# EAGLE design 612_jetracer_328_020018 (EAGLE 9.6.2)
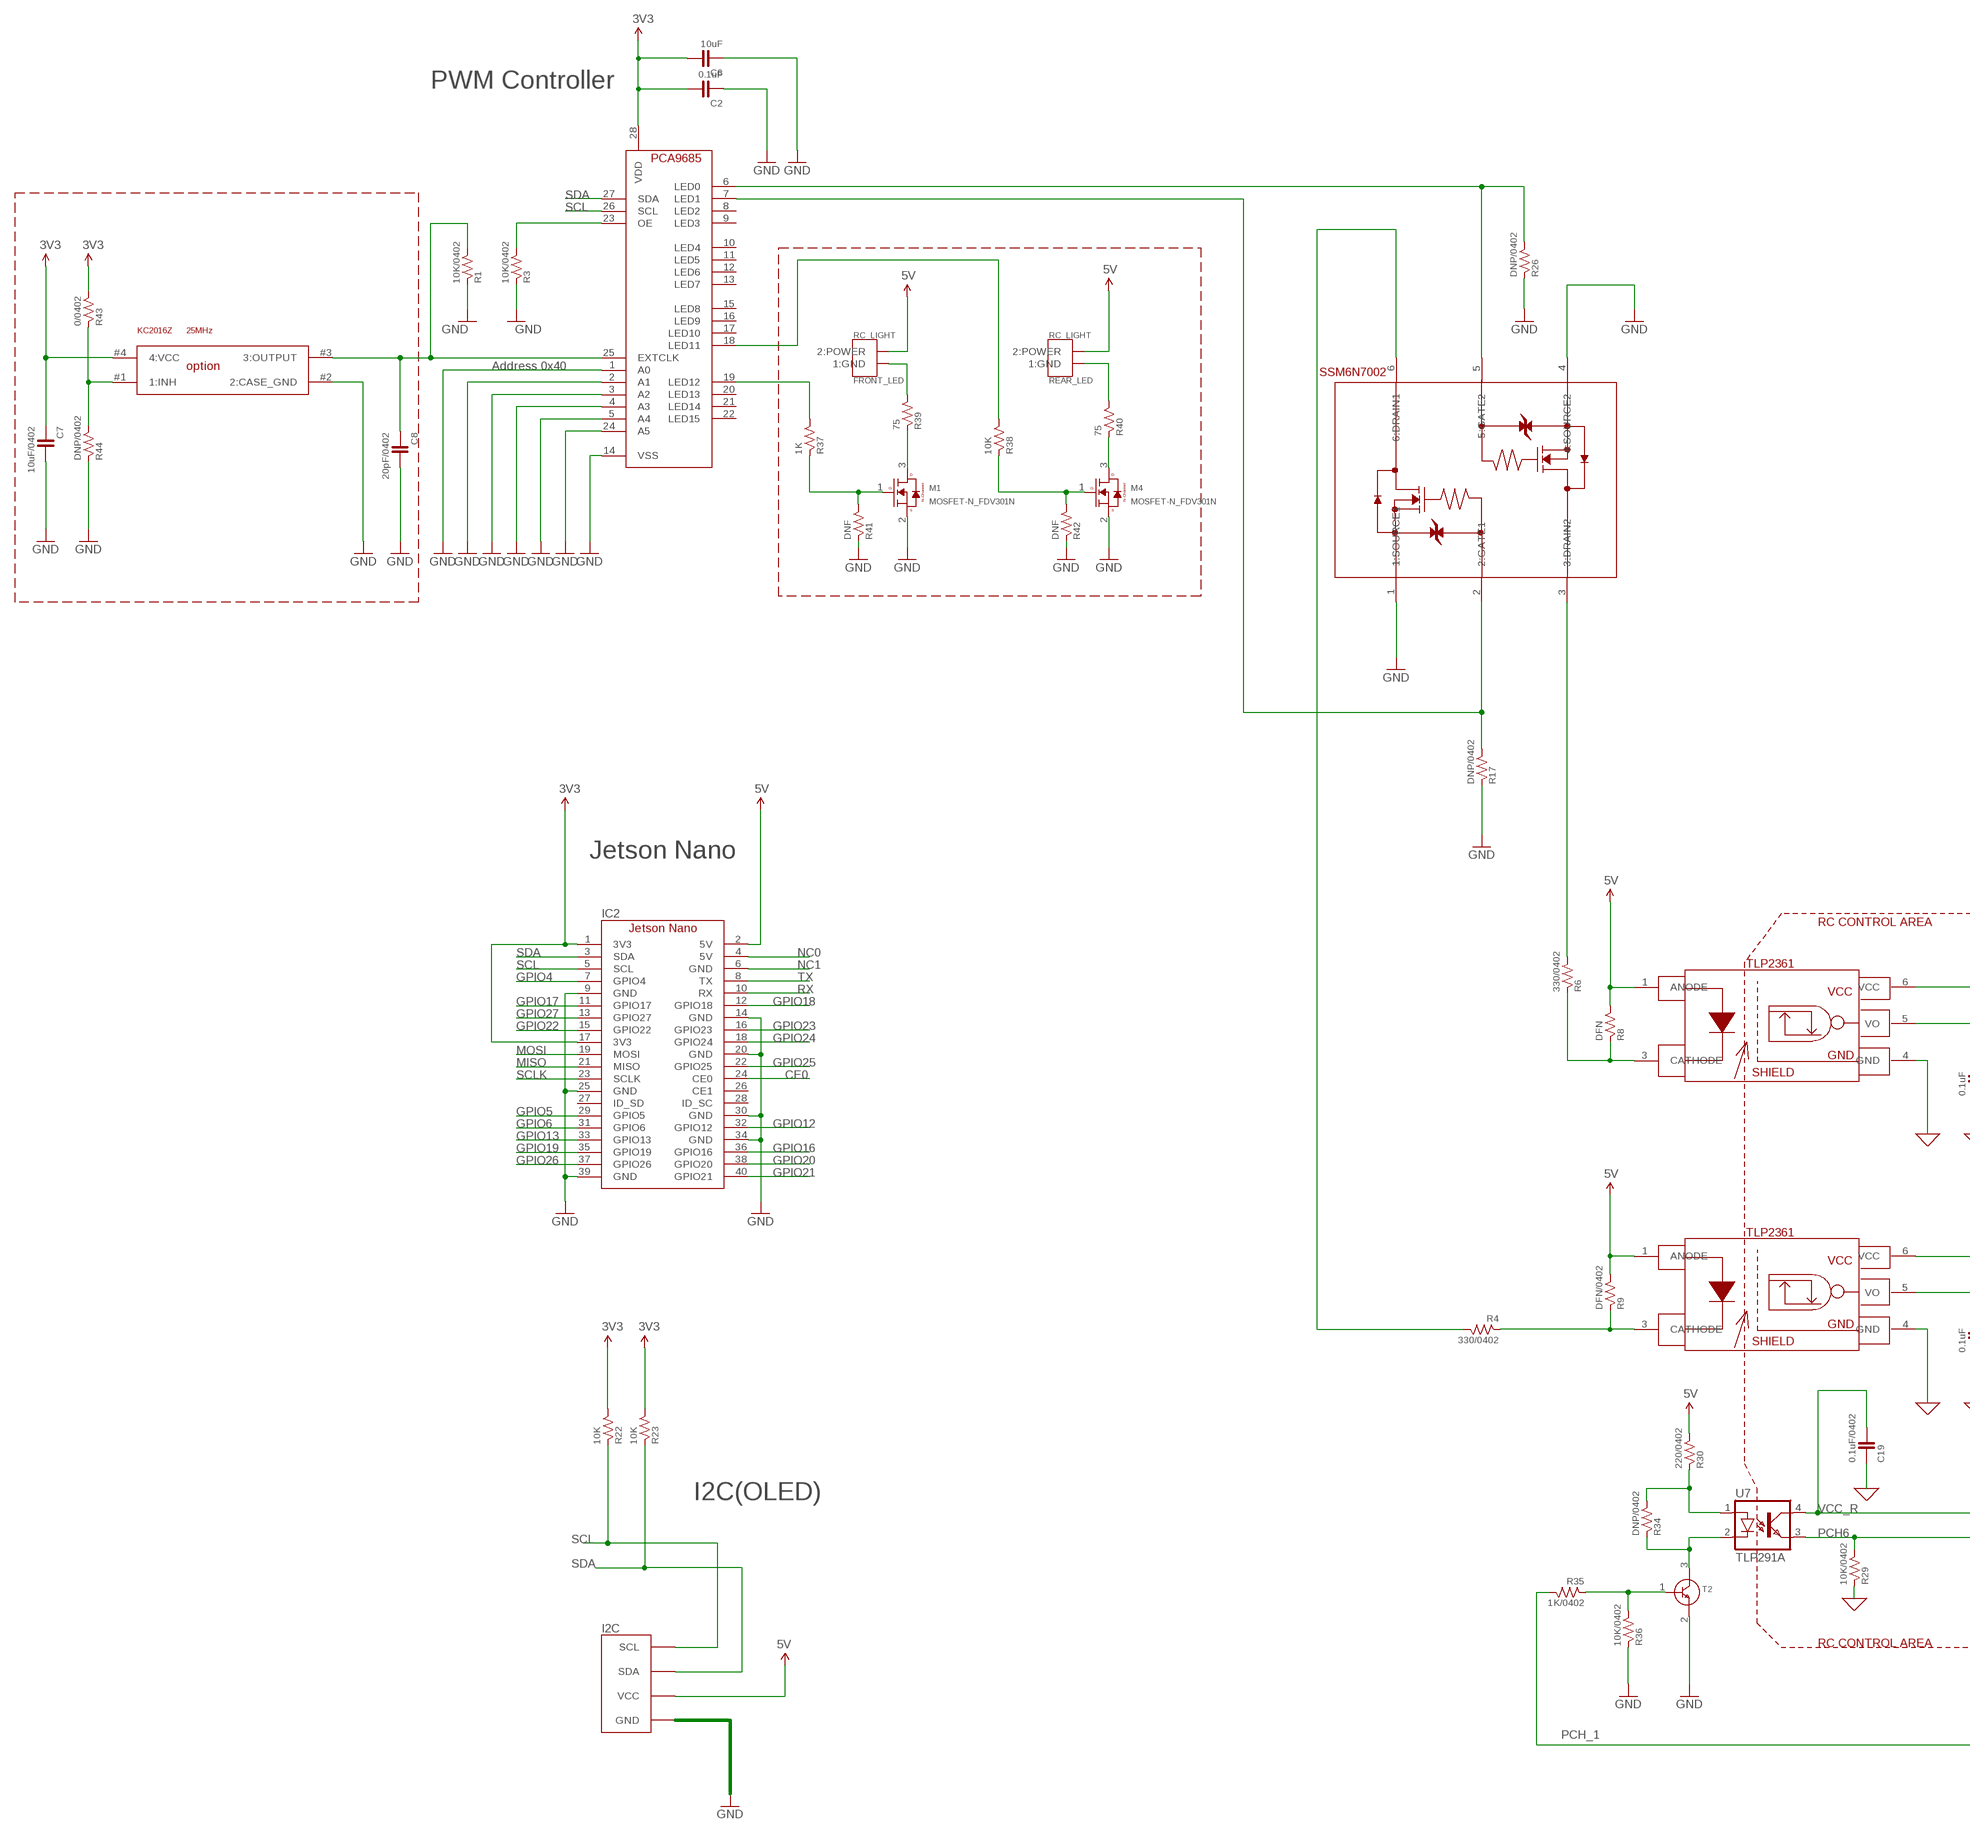
[diagram p0: schematic, sheet 1, part 1 of 3]
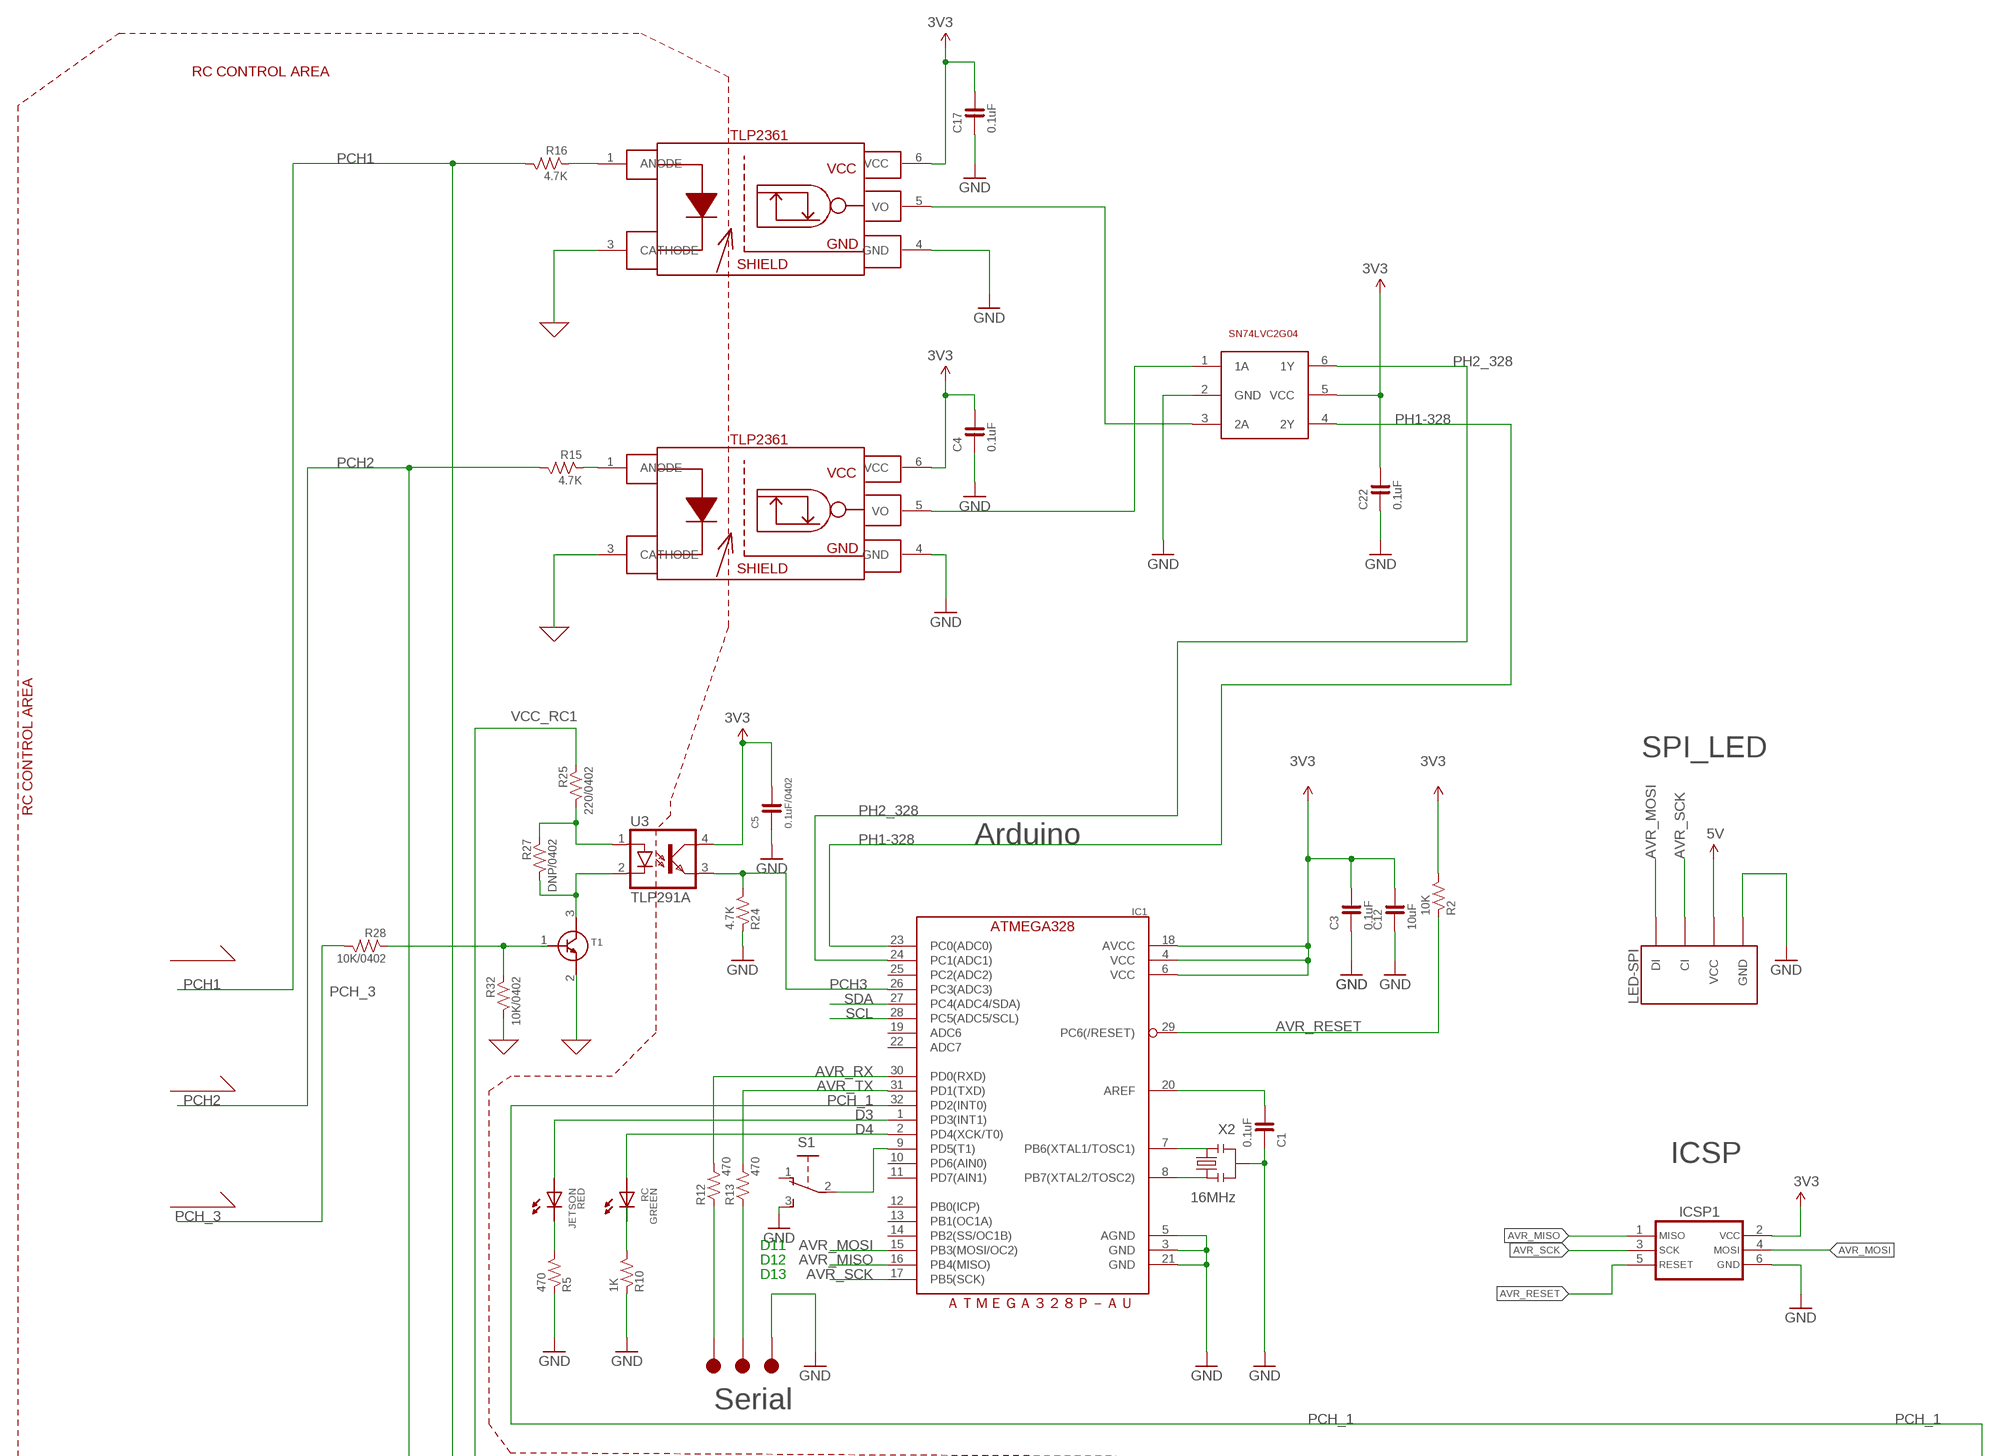
[diagram p1: schematic, sheet 1, part 2 of 3]
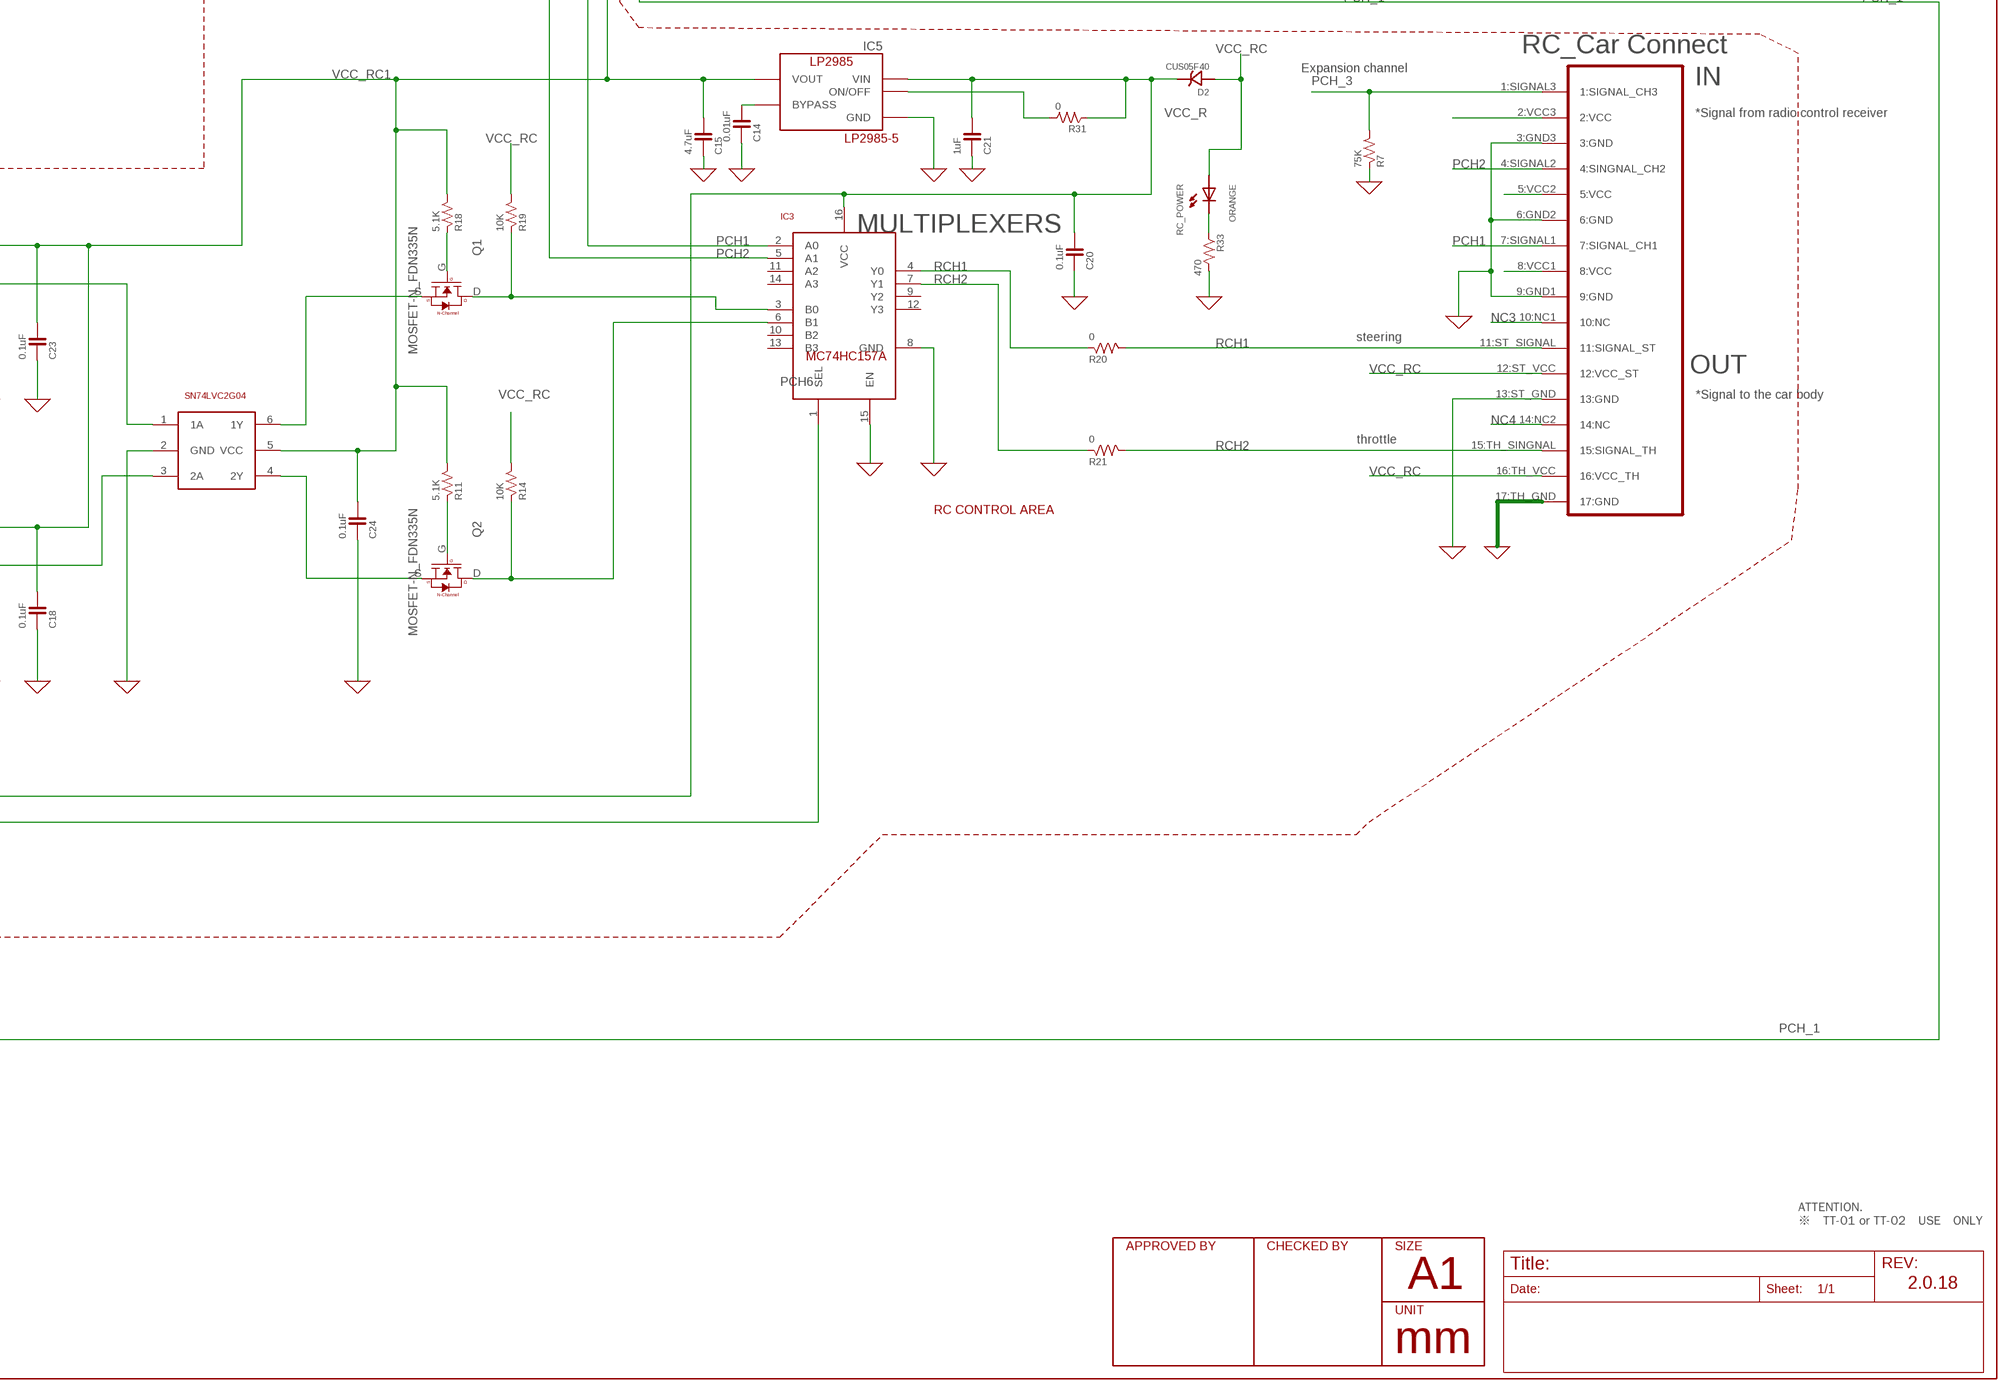
[diagram p2: schematic, sheet 1, part 3 of 3]

## Parts
C1  0.1uF  CAPACITOR-0603  [0603]
C2  0.1uF  CAPACITOR-0603  [0603]
C3  0.1uF  CAPACITOR-0402  [0402]
C4  0.1uF  CAPACITOR-0402  [0402]
C5  0.1uF/0402  CAPACITOR-0402  [0402]
C6  10uF  CAPACITOR-0603  [0603]
C7  10uF/0402  CAPACITOR-0402  [0402]
C8  20pF/0402  CAPACITOR-0402  [0402]
C12  10uF  CAPACITOR-0402  [0402]
C14  0.01uF  CAPACITOR-0603  [0603]
C15  4.7uF  CAPACITOR-0603  [0603]
C17  0.1uF  CAPACITOR-0603  [0603]
C18  0.1uF  CAPACITOR-0603  [0603]
C19  0.1uF/0402  CAPACITOR-0402  [0402]
C20  0.1uF  CAPACITOR-0603  [0603]
C21  1uF  CAPACITOR-0603  [0603]
C22  0.1uF  CAPACITOR-0402  [0402]
C23  0.1uF  CAPACITOR-0603  [0603]
C24  0.1uF  CAPACITOR-0603  [0603]
D2  CUS05F40  [CUS05F40]
FRONT_LED  RC_LIGHT  [PNHEADER_2.54_SMT_LEDLIGHT]
I2C  FABO-I2C_BM04B  [I2C-BM04B-PASS-1]
IC1  ATMEGA328P-AU  [TQFP-32]
IC2  JETSON_NANO_NOBORDER  [JETSON_NANO_NOBOARDER]
IC3  MULTIPLEXERSMC74HC157A  [TSSOP-16]
IC4  PCA9685_BOTTOM  [PCA9685_BOTTOM]
IC5  LP2985-33DBV  [SOT-23-5]
ICSP1  ICSP_AVR-TC_NOHOLE  [TC2030]
JETSON  GREEN  LED-0603  [0603]
LED-SPI  FABO-SPI-LED-BM04B  [SPI-BM04B-PASS-1]
M1  MOSFET-N_FDV301N  [SOT-23]
M4  MOSFET-N_FDV301N  [SOT-23]
Q1  MOSFET-N_FDN335N  [SUPERSOT-3]
Q2  MOSFET-N_FDN335N  [SUPERSOT-3]
R1  10K/0402  RESISTOR-0402  [0402]
R2  10K  RESISTOR-0603  [0603]
R3  10K/0402  RESISTOR-0402  [0402]
R4  330/0402  RESISTOR-0402  [0402]
R5  470  RESISTOR-0603  [0603]
R6  330/0402  RESISTOR-0402  [0402]
R7  75K  RESISTOR-0603  [0603]
R8  DFN  RESISTOR-0603  [0603]
R9  DFN/0402  RESISTOR-0402  [0402]
R10  1K  RESISTOR-0603  [0603]
R11  5.1K  RESISTOR-0603  [0603]
R12  470  RESISTOR-0603  [0603]
R13  470  RESISTOR-0603  [0603]
R14  10K  RESISTOR-0603  [0603]
R15  4.7K  RESISTOR-0603  [0603]
R16  4.7K  RESISTOR-0603  [0603]
R17  DNP/0402  RESISTOR-0402  [0402]
R18  5.1K  RESISTOR-0603  [0603]
R19  10K  RESISTOR-0603  [0603]
R20  0  RESISTOR-0603  [0603]
R21  0  RESISTOR-0603  [0603]
R22  10K  RESISTOR-0603  [0603]
R23  10K  RESISTOR-0603  [0603]
R24  4.7K  RESISTOR-0603  [0603]
R25  220/0402  RESISTOR-0402  [0402]
R26  DNP/0402  RESISTOR-0402  [0402]
R27  DNP/0402  RESISTOR-0402  [0402]
R28  10K/0402  RESISTOR-0402  [0402]
R29  10K/0402  RESISTOR-0402  [0402]
R30  220/0402  RESISTOR-0402  [0402]
R31  0  RESISTOR-0603  [0603]
R32  10K/0402  RESISTOR-0402  [0402]
R33  470  RESISTOR-0603  [0603]
R34  DNP/0402  RESISTOR-0402  [0402]
R35  1K/0402  RESISTOR-0402  [0402]
R36  10K/0402  RESISTOR-0402  [0402]
R37  1K  RESISTOR-0603  [0603]
R38  10K  RESISTOR-0603  [0603]
R39  75  RESISTOR-0603  [0603]
R40  75  RESISTOR-0603  [0603]
R41  DNF  RESISTOR-0603  [0603]
R42  DNF  RESISTOR-0603  [0603]
R43  0/0402  RESISTOR-0402  [0402]
R44  DNP/0402  RESISTOR-0402  [0402]
RC  RED  LED-0603  [0603]
RC_POWER  ORANGE  LED-0603  [0603]
REAR_LED  RC_LIGHT  [PNHEADER_2.54_SMT_LEDLIGHT]
S1  SLIDE-SSSS810701  [SSSS810701]
T1  TRANSISTOR-NPN  [SOT-23]
T2  TRANSISTOR-NPN  [SOT-23]
T5  SN74LVC2G04  [SOT-23-6]
T6  SN74LVC2G04  [SOT-23-6]
TP1  TP-15  [TP-15]
TP2  TP-15  [TP-15]
TP3  TP-15  [TP-15]
U3  TLP291A  [11-3C1]
U7  TLP291A  [11-3C1]
U8  TLP2361  [TLP2361]
U9  TLP2361  [TLP2361]
U10  TLP2361  [TLP2361]
U11  TLP2361  [TLP2361]
U$1  RC_17PIN_OUTIN  [PNHEADER_2.54_SMT_17PIN_RC_TT01_02]
U$6  SSM6N7002KFU  [US6]
U$11  KC2016Z  [KC2016Z]
X2  16MHz  RESONATOR  [CSTNE_V_C]

## Nets
0: C14.1 C15.1 C18.1 C19.1 C20.1 C21.1 C23.1 C24.1 IC3.8(GND) IC3.15(EN) IC5.2(GND) R7.1 R29.1 R32.2 R33.2 T1.2(E) T6.2(GND) U8.3(CATHODE) U9.3(CATHODE) U10.4(GND) U11.4(GND) U$1.3:GND3(3:GND) U$1.6:GND2(6:GND) U$1.9:GND1(9:GND) U$1.13:ST_GND(13:GND) U$1.17:TH_GND(17:GND) ; supply symbol labelled GND
3V3: C2.2 C3.2 C4.2 C5.2 C6.2 C7.1 C12.2 C17.2 C22.2 IC1.4(VCC) IC1.6(VCC) IC1.18(AVCC) IC2.1(3V3) IC2.17(3V3) IC4.28(VDD) ICSP1.2 R2.2 R22.2 R23.2 R43.2 T5.5(VCC) U3.4(COL) U8.6(VCC) U9.6(VCC) U$11.#4(4:VCC)
5V: FRONT_LED.2:POWER I2C.5V(VCC) IC2.2(5V) LED-SPI.5V(VCC) R8.2 R9.2 R30.2 REAR_LED.2:POWER U10.1(ANODE) U11.1(ANODE)
AVR_MISO: IC1.16(PB4(MISO)) ICSP1.1
AVR_MOSI: IC1.15(PB3(MOSI/OC2)) ICSP1.4 LED-SPI.DI
AVR_RESET: IC1.29(PC6(/RESET)) ICSP1.5 R2.1
AVR_RX: IC1.30(PD0(RXD)) R12.2
AVR_SCK: IC1.17(PB5(SCK)) ICSP1.3 LED-SPI.CI
AVR_TX: IC1.31(PD1(TXD)) R13.2
CE0: IC2.24(CE0)
D3: IC1.1(PD3(INT1)) RC.ANODE
D4: IC1.2(PD4(XCK/T0)) JETSON.ANODE
GND: C1.1 C2.1 C3.1 C4.1 C5.1 C6.1 C7.2 C8.2 C12.1 C17.1 C22.1 I2C.GND IC1.3(GND) IC1.5(AGND) IC1.21(GND) IC2.9(GND) IC2.14(GND) IC2.20(GND) IC2.25(GND) IC2.30(GND) IC2.34(GND) IC2.39(GND) IC4.1(A0) IC4.2(A1) IC4.3(A2) IC4.4(A3) IC4.5(A4) IC4.14(VSS) IC4.24(A5) ICSP1.6 LED-SPI.GND M1.2(S) M4.2(S) R1.1 R3.1 R5.1 R10.1 R17.1 R24.1 R26.1 R36.1 R41.1 R42.1 R44.1 S1.3 T2.2(E) T5.2(GND) TP3.1 U8.4(GND) U9.4(GND) U$6.1(1:SOURCE1) U$6.4(4:SOURCE2) U$11.#2(2:CASE_GND) X2.2
GPIO4: IC2.7(GPIO4)
GPIO5: IC2.29(GPIO5)
GPIO6: IC2.31(GPIO6)
GPIO12: IC2.32(GPIO12)
GPIO13: IC2.33(GPIO13)
GPIO16: IC2.36(GPIO16)
GPIO17: IC2.11(GPIO17)
GPIO18: IC2.12(GPIO18)
GPIO19: IC2.35(GPIO19)
GPIO20: IC2.38(GPIO20)
GPIO21: IC2.40(GPIO21)
GPIO22: IC2.15(GPIO22)
GPIO23: IC2.16(GPIO23)
GPIO24: IC2.18(GPIO24)
GPIO25: IC2.22(GPIO25)
GPIO26: IC2.37(GPIO26)
GPIO27: IC2.13(GPIO27)
MISO: IC2.21(MISO)
MOSI: IC2.19(MOSI)
N$2: IC4.7(LED1) R17.2 U$6.2(2:GATE1)
N$3: IC3.3(B0) Q1.D R19.1
N$4: C1.2 IC1.20(AREF)
N$5: IC1.8(PB7(XTAL2/TOSC2)) X2.3
N$6: R12.1 TP1.1
N$7: IC4.23(OE) R3.2
N$8: C8.1 IC4.25(EXTCLK) R1.2 U$11.#3(3:OUTPUT)
N$9: R15.1 U9.1(ANODE)
N$10: T5.1(1A) U9.5(VO)
N$11: T5.3(2A) U8.5(VO)
N$12: R16.1 U8.1(ANODE)
N$13: IC4.6(LED0) R26.2 U$6.5(5:GATE2)
N$14: T6.1(1A) U10.5(VO)
N$15: IC1.7(PB6(XTAL1/TOSC1)) X2.1
N$16: IC1.9(PD5(T1)) S1.2
N$17: R13.1 TP2.1
N$18: T6.3(2A) U11.5(VO)
N$19: R5.2 RC.CATHODE
N$20: JETSON.CATHODE R10.2
N$21: R4.2 U$6.6(6:DRAIN1)
N$22: R6.2 U$6.3(3:DRAIN2)
N$23: R6.1 R8.1 U10.3(CATHODE)
N$24: R4.1 R9.1 U11.3(CATHODE)
N$25: R25.2 R27.1 U3.1(A)
N$26: R27.2 T1.3(C) U3.2(C)
N$27: R28.1 R32.1 T1.1(B)
N$28: R33.1 RC_POWER.CATHODE
N$29: R35.1 R36.2 T2.1(B)
N$30: R34.1 T2.3(C) U7.2(C)
N$31: C14.2 IC5.4(BYPASS)
N$32: IC5.3(ON/OFF) R31.2
N$33: R30.1 R34.2 U7.1(A)
N$34: Q2.S T6.4(2Y)
N$35: R21.2 U$1.15:TH_SINGNAL(15:SIGNAL_TH)
N$36: R20.2 U$1.11:ST_SIGNAL(11:SIGNAL_ST)
N$37: Q1.S T6.6(1Y)
N$38: IC4.19(LED12) R37.2
N$39: Q2.G R11.1
N$40: Q1.G R18.1
N$41: IC4.18(LED11) R38.2
N$42: IC3.6(B1) Q2.D R14.1
N$43: M1.1(G) R37.1 R41.2
N$44: M4.1(G) R38.1 R42.2
N$45: FRONT_LED.1:GND R39.2
N$46: M1.3(D) R39.1
N$47: M4.3(D) R40.1
N$48: R40.2 REAR_LED.1:GND
N$49: R43.1 R44.2 U$11.#1(1:INH)
NC0: IC2.4(5V)
NC1: IC2.6(GND)
NC3: U$1.10:NC1(10:NC)
NC4: U$1.14:NC2(14:NC)
PCH1: IC3.2(A0) R16.2 U$1.7:SIGNAL1(7:SIGNAL_CH1)
PCH2: IC3.5(A1) R15.2 U$1.4:SIGNAL2(4:SINGNAL_CH2)
PCH3: IC1.26(PC3(ADC3)) R24.2 U3.3(EMI)
PCH6: IC3.1(SEL) R29.2 U7.3(EMI)
PCH_1: IC1.32(PD2(INT0)) R35.2
PCH_3: R7.2 R28.2 U$1.1:SIGNAL3(1:SIGNAL_CH3)
PH1-328: IC1.23(PC0(ADC0)) T5.4(2Y)
PH2_328: IC1.24(PC1(ADC1)) T5.6(1Y)
RCH1: IC3.4(Y0) R20.1
RCH2: IC3.7(Y1) R21.1
RX: IC2.10(RX)
SCL: I2C.SCL IC1.28(PC5(ADC5/SCL)) IC2.5(SCL) IC4.26(SCL) R22.1
SCLK: IC2.23(SCLK)
SDA: I2C.SDA IC1.27(PC4(ADC4/SDA)) IC2.3(SDA) IC4.27(SDA) R23.1
TX: IC2.8(TX)
VCC_R: C19.2 C20.2 C21.2 D2.C(CATHODE) IC3.16(VCC) IC5.1(VIN) R31.1 U7.4(COL)
VCC_RC: D2.A(ANODE) R14.2 R19.2 RC_POWER.ANODE U$1.2:VCC3(2:VCC) U$1.5:VCC2(5:VCC) U$1.8:VCC1(8:VCC) U$1.12:ST_VCC(12:VCC_ST) U$1.16:TH_VCC(16:VCC_TH)
VCC_RC1: C15.2 C18.2 C23.2 C24.2 IC5.5(VOUT) R11.2 R18.2 R25.1 T6.5(VCC) U10.6(VCC) U11.6(VCC)
Unconnected: IC1.10(PD6(AIN0)) IC1.11(PD7(AIN1)) IC1.12(PB0(ICP)) IC1.13(PB1(OC1A)) IC1.14(PB2(SS/OC1B)) IC1.19(ADC6) IC1.22(ADC7) IC1.25(PC2(ADC2)) IC2.26(CE1) IC2.27(ID_SD) IC2.28(ID_SC) IC3.9(Y2) IC3.10(B2) IC3.11(A2) IC3.12(Y3) IC3.13(B3) IC3.14(A3) IC4.8(LED2) IC4.9(LED3) IC4.10(LED4) IC4.11(LED5) IC4.12(LED6) IC4.13(LED7) IC4.15(LED8) IC4.16(LED9) IC4.17(LED10) IC4.20(LED13) IC4.21(LED14) IC4.22(LED15) S1.1

## Notes on the sheet
- RC CONTROL AREA
- PWM Controller
- SPI_LED
- RC CONTROL AREA
- Arduino
- option | Address 0x40
- ICSP
- D11
- D12
- D13
- ＡＴＭＥＧＡ３２８Ｐ－ＡＵ
- Serial
- RC_Car Connect
- Expansion channel
- IN
- Jetson Nano
- *Signal from radio control receiver
- LP2985-5
- RC CONTROL AREA
- MULTIPLEXERS
- steering
- MC74HC157A
- OUT
- *Signal to the car body
- throttle
- RC CONTROL AREA
- I2C(OLED)
- RC CONTROL AREA
- ATTENTION.
  ※　TT-01 or TT-02　USE　ONLY
- 2.0.18

## Library data of the parts
C1-C8 C12 C14 C15 C17 C20-C22 = FaBo-Capacitor:CAPACITOR: CAPACITOR
C18 C19 C23 C24 = FaBo-Capacitor:CAPACITOR: CAPACITOR; SPICEPREFIX: C
D2 = FaBo-Diode:CUS05F40
FRONT_LED REAR_LED = FaBo-PIN:RC_LIGHT
I2C = FaBo-Connetor:FABO-I2C
IC1 = component:ATMEGA328
IC2 = FaBo-Boards:JETSON_NANO
IC3 = FaBo-Multiplexers:MULTIPLEXERS
IC4 = FaBo-Motor:PCA9685
IC5 = FaBo-Supply:LP2985: LP2985
ICSP1 = component:ICSP_AVR
JETSON RC RC_POWER = FaBo-LED:LED
LED-SPI = FaBo-Connetor:FABO-SPI-LED
M1 M4 Q1 Q2 = FaBo-Mosfet:MOSFET-N
R1-R44 = FaBo-Resistors:RESISTOR: RESISTOR
S1 = FaBo-Switch:SLIDE
T1 T2 = FaBo-Transistor:TRANSISTOR
T5 T6 = FaBo-Transistor:SN74LVC2G04
TP1-TP3 = FaBo-Supply:TP
U3 U7 = FaBo_Photocoupler:TLP291A
U8-U11 = FaBo-etc:TLP2361
U$1 = FaBo-PIN:RC_17PIN_OUTIN
U$6 = FaBo-Mosfet:SSM6N7002KFU
U$11 = FaBo-Crystal:KC2016Z
X2 = component:RESONATOR

## Board
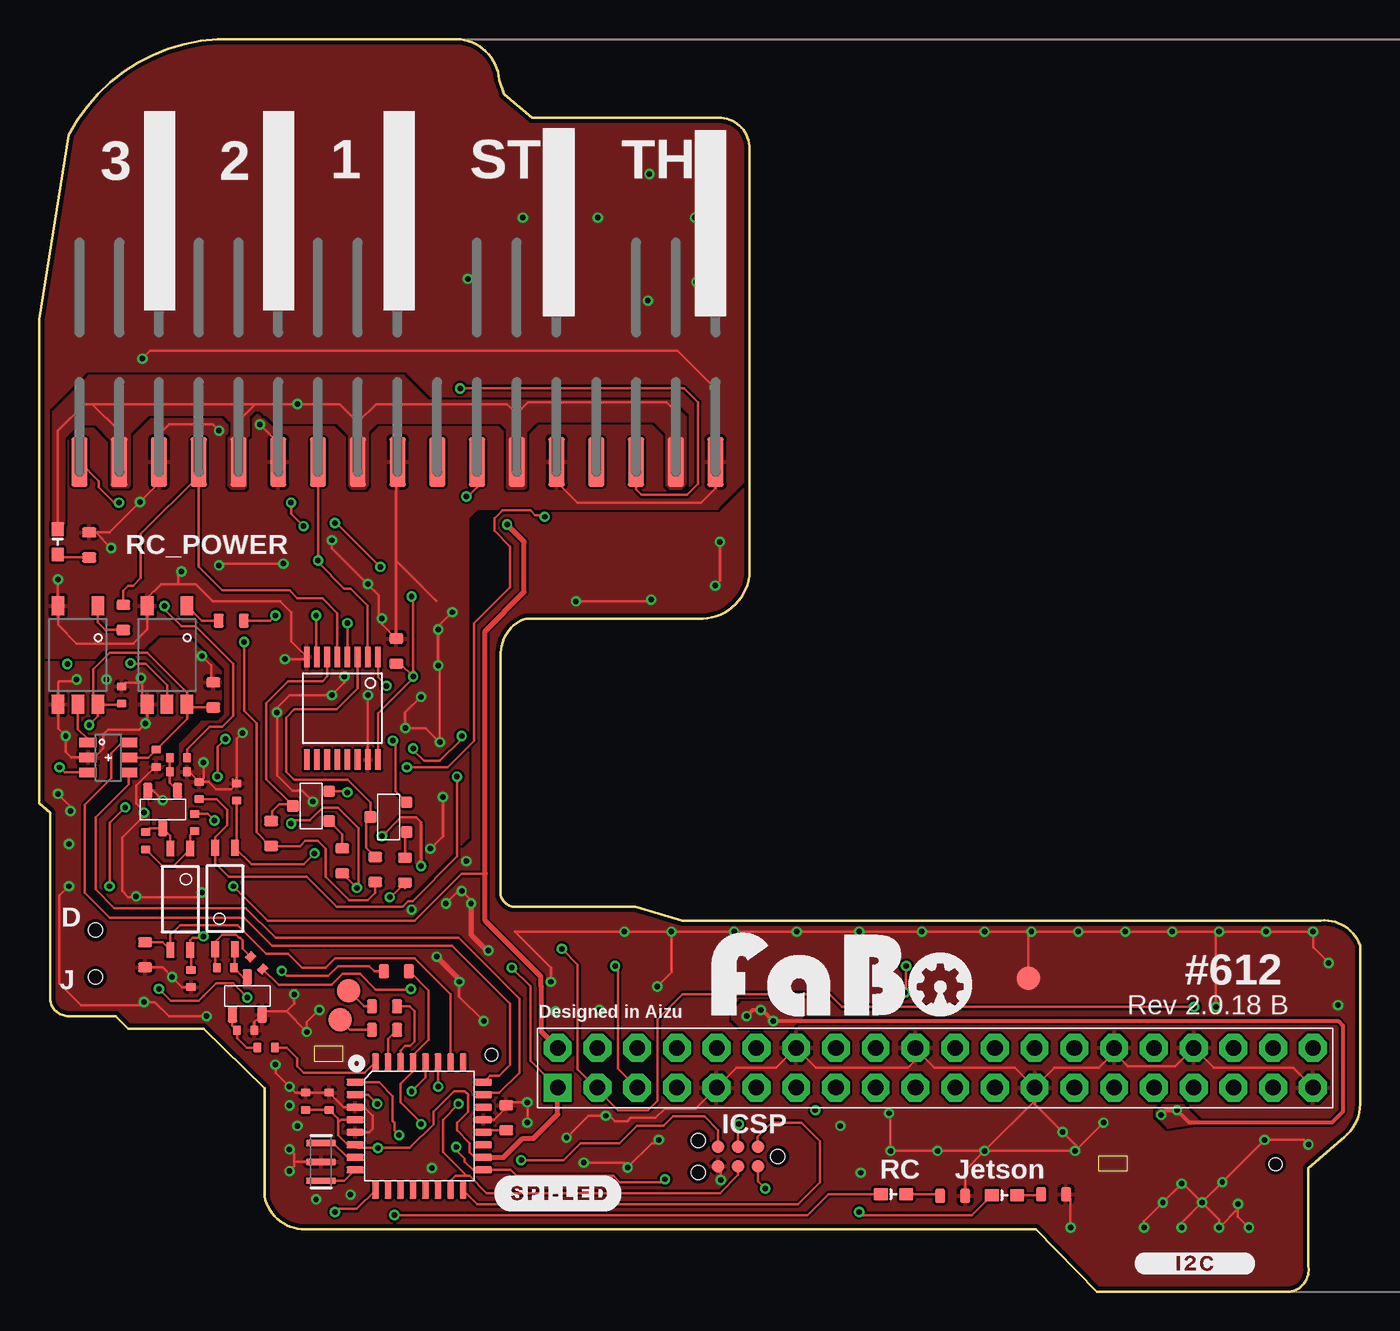
[diagram p3: board, top side]
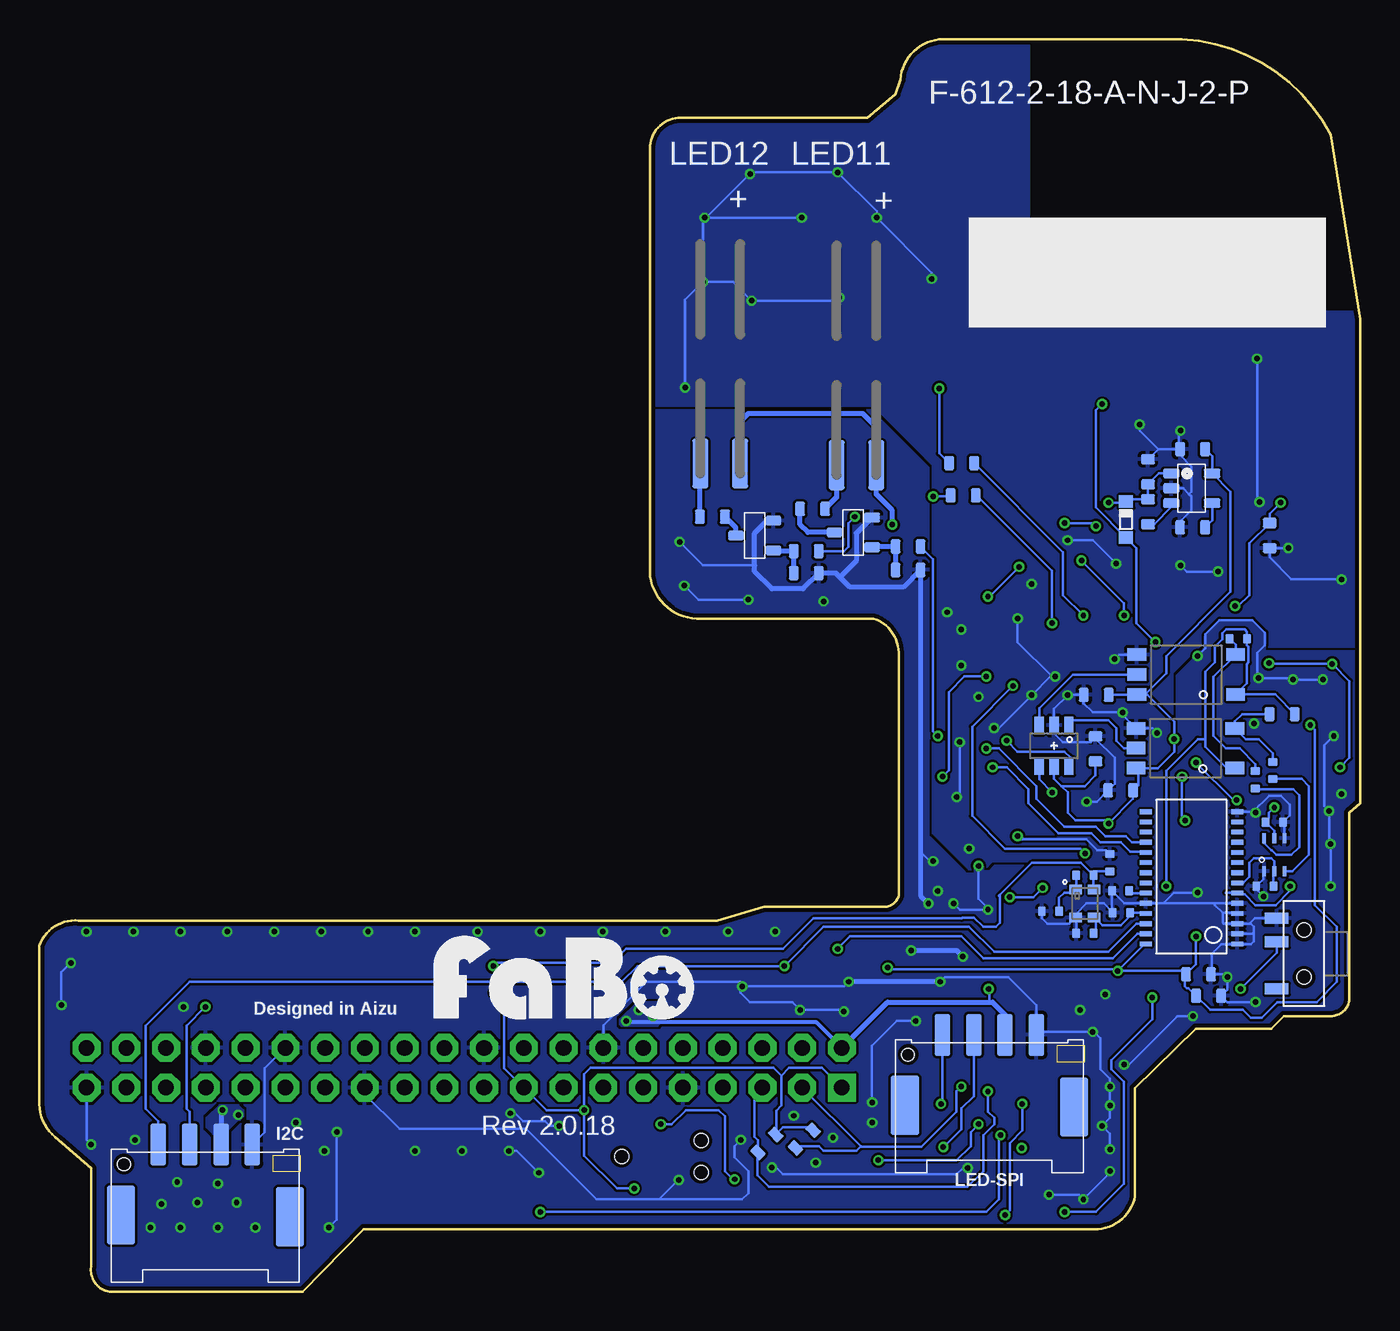
[diagram p4: board, bottom side, seen from below]

Size 84.42 x 80.01 mm. Coordinates in mm from the lower left corner, seen from the top.
Outline: 0,31.2 0,62.1 1.9,73.9 arc-60 11.4,80 26.4,80 arc-90 29.4,77.4 29.7,76.5 31.5,75 43.4,75 arc-90 45.4,73 45.4,46 arc-86 42.4,43 31.1,43 arc71 29.5,40.8 29.5,25.3 arc85 30.6,24.6 38.1,24.6 41.1,23.7 81.9,23.7 arc-78 84.4,22.1 84.4,12.5 arc-61 83.2,9.7 81.1,7.9 81.1,1.6 arc-90 79.9,0 67.6,0 63.7,4 17,4 arc-80 14.4,6.1 14.4,13 10.5,16.8 5.7,16.8 4.9,17.6 1.9,17.6 arc-85 0.7,18.7 0.7,30.6 0,31.2
Copper layers (1*16): Top 0.035mm / dielectric 1.6mm / Bottom 0.035mm
Design rules "PCBway": minimum track width 6mil, minimum drill 12mil, track to track 6mil, track to pad 6mil, pad to pad 6mil, via to via 6mil, smd to smd 6mil, copper to edge 10mil, drill to drill 10mil, minimum pad ring 10mil, minimum via ring 6mil, stop-mask expansion 2mil, vias tented up to drill 100mil, thermal gap 8mil
tKeepout: area 17,14.3 to 19.8,16.1; area 67.2,7.3 to 70,9.1
bKeepout: area 2.5,70.2 to 27,91.4
tRestrict: 2 lines
bRestrict: area -2.9,62.7 to 21.1,82.8

### Footprints (pad centres in the part's own frame; a part is rotated, then mirrored left to right if it is on the bottom)
0603 = smd 0.65 x 0.9: 1 -0.8,0; 2 0.8,0
0402 = smd 0.5 x 0.6: 1 -0.55,0; 2 0.55,0
CUS05F40 = smd 0.8 x 0.9: A -1.15,0; C 1.15,0
PNHEADER_2.54_SMT_LEDLIGHT = smd 1.02 x 3.17: 1:GND -1.27,0; 2:POWER 1.27,0
I2C-BM04B-PASS-1 = smd 1 x 2.7: 5V -1,0; GND -3,0; SCL 3,0; SDA 1,0 | smd 1.8 x 3.8: P$5 -5.4,4.6; P$6 5.4,4.5 | hole 0.8: 5.2,1.25
TQFP-32 = smd 1.1 x 0.45: 1 -4.1,2.8; 2 -4.1,2; 3 -4.1,1.2; 4 -4.1,0.4; 5 -4.1,-0.4; 6 -4.1,-1.2; 7 -4.1,-2; 8 -4.1,-2.8; 17 4.1,-2.8; 18 4.1,-2; 19 4.1,-1.2; 20 4.1,-0.4; 21 4.1,0.4; 22 4.1,1.2; 23 4.1,2; 24 4.1,2.8 | smd 0.45 x 1.1: 9 -2.8,-4.1; 10 -2,-4.1; 11 -1.2,-4.1; 12 -0.4,-4.1; 13 0.4,-4.1; 14 1.2,-4.1; 15 2,-4.1; 16 2.8,-4.1; 25 2.8,4.1; 26 2,4.1; 27 1.2,4.1; 28 0.4,4.1; 29 -0.4,4.1; 30 -1.2,4.1; 31 -2,4.1; 32 -2.8,4.1
JETSON_NANO_NOBOARDER = drill 1 pad 1.778 square: 1 1.27,1.27 | drill 1 pad 1.778 octagon: 2 1.27,3.81; 3 3.81,1.27; 4 3.81,3.81; 5 6.35,1.27; 6 6.35,3.81; 7 8.89,1.27; 8 8.89,3.81; 9 11.43,1.27; 10 11.43,3.81; 11 13.97,1.27; 12 13.97,3.81; 13 16.51,1.27; 14 16.51,3.81; 15 19.05,1.27; 16 19.05,3.81; 17 21.59,1.27; 18 21.59,3.81; 19 24.13,1.27; 20 24.13,3.81; 21 26.67,1.27; 22 26.67,3.81; 23 29.21,1.27; 24 29.21,3.81; 25 31.75,1.27; 26 31.75,3.81; 27 34.29,1.27; 28 34.29,3.81; 29 36.83,1.27; 30 36.83,3.81; 31 39.37,1.27; 32 39.37,3.81; 33 41.91,1.27; 34 41.91,3.81; 35 44.45,1.27; 36 44.45,3.81; 37 46.99,1.27; 38 46.99,3.81; 39 49.53,1.27; 40 49.53,3.81
TSSOP-16 = smd 0.36 x 1.3: 1 -2.275,-3.28; 2 -1.625,-3.28; 3 -0.975,-3.28; 4 -0.325,-3.28; 5 0.325,-3.28; 6 0.975,-3.28; 7 1.625,-3.28; 8 2.275,-3.28; 9 2.275,3.28; 10 1.625,3.28; 11 0.975,3.28; 12 0.325,3.28; 13 -0.325,3.28; 14 -0.975,3.28; 15 -1.625,3.28; 16 -2.275,3.28
PCA9685_BOTTOM = smd 0.3 x 0.75 bottom: 1 4.3,-2.93; 2 3.65,-2.93; 3 3,-2.93; 4 2.35,-2.93; 5 1.7,-2.93; 6 1.05,-2.93; 7 0.4,-2.93; 8 -0.25,-2.93; 9 -0.9,-2.93; 10 -1.55,-2.93; 11 -2.2,-2.93; 12 -2.85,-2.93; 13 -3.5,-2.93; 14 -4.15,-2.93; 15 -4.15,2.92; 16 -3.5,2.92; 17 -2.85,2.92; 18 -2.2,2.92; 19 -1.55,2.92; 20 -0.9,2.92; 21 -0.25,2.92; 22 0.4,2.92; 23 1.05,2.92; 24 1.7,2.92; 25 2.35,2.92; 26 3,2.92; 27 3.65,2.92; 28 4.3,2.92
SOT-23-5 = smd 0.6 x 1.05: 1 -0.95,-1.3; 2 0,-1.3; 3 0.95,-1.3; 4 0.95,1.3; 5 -0.95,1.3
TC2030 = smd 0.787 x 0.787: 1 1.27,-0.635; 2 1.27,0.635; 3 2.54,-0.635; 4 2.54,0.635; 5 3.81,-0.635; 6 3.81,0.635 | hole 0.889: 0,0; 5.08,-1.016; 5.08,1.016
0603' = smd 0.9 x 0.8: ANODE -0.8,0; CATHODE 0.8,0
SPI-BM04B-PASS-1 = smd 1 x 2.7: 5V -1,-0.1; CI 1,-0.1; DI 3,-0.1; GND -3,-0.1 | smd 1.8 x 3.8: P$5 -5.4,4.5; P$6 5.4,4.4 | hole 0.8: 5.2,1.15
SOT-23 = smd 0.6 x 1: 1 -0.95,-1.2; 2 0.95,-1.2; 3 0,1.2
SUPERSOT-3 = smd 0.76 x 0.76: D 0,1.15; G -0.95,-1.15; S 0.95,-1.15
SSSS810701 = smd 0.7 x 1.5: 1 -2.25,1.75; 2 0.75,1.75; 3 2.25,1.75 | hole 0.9: -1.5,0; 1.5,0
SOT-23-6 = smd 0.6 x 1.1: 1 -0.95,-1.3; 2 0,-1.3; 3 0.95,-1.3; 4 0.95,1.3; 5 0,1.3; 6 -0.95,1.3
TP-15 = smd 1.5 x 1.5: 1 0,0
11-3C1 = smd 1 x 0.5: 1 -3.24,0.635; 2 -3.24,-0.635; 3 3.24,-0.635; 4 3.24,0.635
TLP2361 = smd 0.8 x 1.2: 1 -1.27,-3.15; 3 1.27,-3.15; 4 1.27,3.15; 5 0,3.15; 6 -1.27,3.15
PNHEADER_2.54_SMT_17PIN_RC_TT01_02 = smd 1.02 x 3.17: 1:SIGNAL3 -20.32,0; 2:VCC3 -17.78,0; 3:GND3 -15.24,0; 4:SIGNAL2 -12.7,0; 5:VCC2 -10.16,0; 6:GND2 -7.62,0; 7:SIGNAL1 -5.08,0; 8:VCC1 -2.54,0; 9:GND1 0,0; 10:NC1 2.54,0; 11:ST_SIGNAL 5.08,0; 12:ST_VCC 7.62,0; 13:ST_GND 10.16,0; 14:NC2 12.7,0; 15:TH_SINGNAL 15.24,0; 16:TH_VCC 17.78,0; 17:TH_GND 20.32,0
US6 = smd 0.3 x 0.635: 1 -0.65,-1.05; 2 0,-1.05; 3 0.65,-1.05; 4 0.65,1.05; 5 0,1.05; 6 -0.65,1.05
KC2016Z = smd 0.6 x 0.8: #1 -0.9,-0.6; #2 0.9,-0.6; #3 0.9,0.6; #4 -0.9,0.6
CSTNE_V_C = smd 0.4 x 1.9: 1 1.2,0; 2 0,0; 3 -1.2,0

### Placement (x,y rotation side)
C1  29.84,11.12 270 top
C2  10.35,20.27 180 bottom
C3  18.52,12.17 270 top
C4  5.28,38.12 270 top
C5  9.7,20 90 top
C6  9.7,18.9 180 bottom
C7  16,27.4 90 bottom
C8  17.6,22.9 180 bottom
C12  17.02,12.17 270 top
C14  10.72,48.82 0 bottom
C15  10.72,53.83 0 bottom
C17  11.12,38.12 270 top
C18  16.88,38.12 0 bottom
C19  10.22,32.02 270 top
C20  22.82,40.92 270 top
C21  13.57,52.37 270 bottom
C22  7.47,34.07 90 top
C23  15.32,32.02 0 bottom
C24  16.92,34.67 270 bottom
D2  14.97,49.32 90 bottom
FRONT_LED  40.9,52.9 0 bottom
I2C  73.8,9.4 180 bottom
IC1  24.29,10.59 0 top
IC2  31.86,11.77 0 top
IC3  19.38,37.27 180 top
IC4  10.79,26.51 270 top
IC5  10.78,51.32 270 bottom
ICSP1  47.2,8.63 180 top
JETSON  GREEN  [0603']  54.59,6.24 0 top
LED-SPI  23.7,16.3 180 bottom
M1  38.7,48.3 90 bottom
M4  32.4,48.5 90 bottom
Q1  22.32,30.32 90 top
Q2  17.38,31.02 90 top
R1  15.28,24.22 0 bottom
R2  22.82,20.47 180 top
R3  15.32,25.62 0 bottom
R4  6.7,32.7 270 bottom
R5  64.82,6.22 180 top
R6  5.6,33.3 270 bottom
R7  5.8,48.3 90 bottom
R8  5,36.9 0 bottom
R9  7.8,41.7 0 bottom
R10  58.37,6.12 180 top
R11  19.38,27.52 270 top
R12  22.07,18.23 0 top
R13  22.07,16.73 0 top
R14  14.82,29.27 270 top
R15  5.38,43.07 90 top
R16  12.28,42.87 0 top
R17  6.1,25.9 0 bottom
R18  23.38,26.92 270 top
R19  21.48,26.97 270 top
R20  25.38,50.87 180 bottom
R21  25.48,52.92 180 bottom
R22  37.92,9.47 45 bottom
R23  35.53,9.75 45 bottom
R24  6.78,21.52 90 top
R25  9.93,29.97 270 top
R26  5.5,30 180 bottom
R27  6.8,28.8 90 top
R28  8.9,34.1 0 top
R29  12.62,31.92 270 top
R30  13.9,21 315 top
R31  13.57,49.82 270 bottom
R32  8.9,33.2 0 top
R33  3.2,47.7 90 top
R34  11.9,20.7 180 top
R35  14.5,15.6 0 top
R36  13.2,16.7 180 top
R37  35.4,47.3 0 bottom
R38  28.9,47.6 0 bottom
R39  41.4,49.5 180 bottom
R40  35,50 0 bottom
R41  35.4,45.9 180 bottom
R42  28.9,46.1 180 bottom
R43  17.6,26.6 0 bottom
R44  19.8,24.3 0 bottom
RC  RED  [0603']  61.68,6.17 0 top
RC_POWER  ORANGE  [0603']  1.2,47.9 270 top
REAR_LED  32.2,52.8 0 bottom
S1  3.6,21.6 90 bottom
T1  7.9,30.8 180 top
T2  13.3,18.9 0 top
T5  4.42,34.12 270 top
T6  19.57,34.87 180 bottom
TP1  19.77,19.23 90 top
TP2  19.23,17.38 0 top
TP3  63.21,20.02 0 top
U3  9.03,25.07 270 top
U7  11.88,25.12 90 top
U8  8.18,40.67 180 top
U9  2.48,40.67 180 top
U10  11.18,34.72 90 bottom
U11  11.12,39.42 90 bottom
U$1  22.9,53 0 top
U$2  [LOGO_FABO_L]  50.6,17.6 0 top
U$3  [LOGO_FABO_L]  51.6,17.4 0 bottom
U$6  5.5,27.9 0 bottom
U$11  17.6,24.8 270 bottom
X2  18.01,8.29 90 top

### Tracks (layer width: path | path; a pad name or v marks a point on that pad's centre or on a via)
0  (via drill 0.35)
  Top 0.152: v17.5,31.3 16.8,32 16.2,32 15.2,33 v15.2,37 15.2,37.3 16,38.1 v18.7,38.1 19.5,38.9 v19.5,39.3 | U9.3 1.16,43.86 1.2,43.9 | R29.1 12.62,35.33 v13,35.7 | 22.82,46.7 C20.1 21.9,42.65 v21.9,43 21.7,43.2 21.7,44.5 v21,45.2 18.7,47.5 v18.7,48 | IC3.15 v21,38.1 | v24.4,38 23.4,37 v23.4,36 24.7,36 v25.6,35.1 25.6,39.9 v25.5,40 v25.5,42.3 25.5,42.5 v26.4,43.4 | IC3.8 17.07,40.58 | 17.07,40.58 16.1,41.55 16.1,43.4 15.4,44.1 11.1,44.1 10,45.2 8.9,45.2 | v25.8,31.6 25.8,29.1 v25,28.3 | 25.38,44.15 22.82,46.7 | U9.3 1.21,42.59 2.4,41.4 6,41.4 6.91,42.3 U8.3 6.91,44.32 7.79,45.2 8.9,45.2 | U9.3 v1.2,45.5 | 12.38,32.72 R29.1 | T1.2 7.3,32 v7.9,31.4 | C19.1 10.83,32.57 11.3,32.1 12.26,32.1 R29.1 | R32.2 9.6,33.2 C19.1 | v10.5,33.8 10.5,32.84 C19.1 | 3.6,48.5 4.5,48.5 v6.45,50.45 7.66,51.66 U$1.3:GND3 7.66,54.76 8.3,55.4 11.1,55.4 v11.5,55 | 3.6,48.5 R33.2 | v4.6,47.5 3.6,48.5 | v15.7,40.4 16.9,40.4 17.07,40.58 | v15.6,46.5 11.6,46.5 v11.5,46.4 | v9.1,46 8.9,45.8 8.9,45.2 | U$1.9:GND1 22.82,52.92 22.82,46.7 | U$1.6:GND2 15.28,54.22 v14.1,55.4 | v6.6,59.6 7.1,60.1 40.8,60.1 v43.15,57.75 43.22,57.68 U$1.17:TH_GND 43.22,51.32 42.3,50.4 34.41,50.4 33.06,51.74 U$1.13:ST_GND
  Bottom 0.152: v13,35.7 13.29,35.99 U10.4 15.2,36.87 v15.2,37 17.1,37 17.7,37.6 17.7,38.12 C18.1 18.68,38.12 v18.7,38.1 19.57,37.23 T6.2 19.57,35.67 19,35.1 17.22,35.1 16.92,35.4 | 19.7,39.3 19.8,39.3 v21,38.1 23.1,36 v23.4,36 | 19.7,39.3 v19.5,39.3 | 19.7,39.3 21.9,41.5 v21.9,43 | v17.5,31.3 16.84,31.3 C23.1 15.7,32.45 15.7,34.1 16.92,35.32 16.92,35.4 | C24.1 16.92,35.4 | v7.9,31.4 8.1,31.4 v10.5,33.8 | v25.6,35.1 25.6,31.8 v25.8,31.6 | v4.6,47.5 R7.1 5.8,46.9 4.4,45.5 v1.2,45.5 | C21.1 12.92,53.83 | 12.92,53.83 11.6,53.83 | 11.6,53.83 C15.1 11.52,53.42 10.8,52.7 10.8,51.1 10.95,50.95 | C14.1 11.53,49.17 10.8,49.9 10.8,50.8 10.95,50.95 | 10.95,50.95 11.32,51.32 IC5.2 | v11.5,55 11.6,54.9 11.6,53.83 | U11.4 15.41,40.69 v15.7,40.4 | v18.7,48 17.1,48 v15.6,46.5 | v11.5,46.4 11.1,46 v9.1,46 | v14.1,55.4 14.1,55.01 12.92,53.83 | v6.6,59.6 6.6,50.6 v6.45,50.45 | v27.4,64.7 27.4,65.1 v30.9,68.6 30.9,69 v33.4,71.5 38.9,71.5 v39,71.4 41.8,68.6 v41.9,68.6 | v41.9,68.6 v35.7,68.6 | v41.9,68.6 42,68.5 v42,64.5 | v33.3,63.5 33.5,63.3 v38.9,63.3 40.1,64.5 v42,64.5 | v42,64.5 43.15,63.35 v43.15,57.75
  pour Top (rank 2): 7.7,29.1 7.7,27.8 8.2,27.3 11,27.3 14.7,23.6 22,23.6 27.4,29 27.4,49.4 28,50 43.3,50 48.1,54.8 48.1,77.3 31.3,94.1 2.1,94.1 -3.6,88.4 -3.6,43.8 -0.3,40.5 3.6,40.5 4.1,41 6.6,41 7.6,42 9.7,42 11.9,39.8 11.9,36.9 11.4,36.4 10.4,36.4 9,35 9,33.7 7.8,32.5 7.4,32.5 7,32.1 7,31.1 7.3,30.8 7.3,29.5
  pour Bottom: 15.9,27.5 23.5,27.5 24,27 25,27 27.3,29.3 27.3,52.8 31.1,56.6 47.4,56.6 47.4,75.3 30.4,92.3 3.8,92.3 -1.4,87.1 -1.4,42.7 0.1,41.2 6.4,41.2 7.1,41.9 9.6,41.9 12,39.5 12,36.9 11.3,36.2 11.3,33.9 13.9,31.3 14,31.3 14.5,30.8 14.5,26.1 14.7,25.9 15.1,25.9 15.8,26.6 15.8,27.4
3V3  (via drill 0.35)
  Top 0.152: v46.4,6.6 45.93,7.07 ICSP1.2 | 20.18,11 IC1.4 19.29,10.98 19.1,10.8 | v15.5,20.5 15.83,20.17 18.47,20.17 19.1,20.8 21.1,20.8 21.43,20.47 R2.2 | IC2.1 31.4,14.77 31.4,19.5 v30.2,20.7 | U8.6 9.45,38.26 6.9,40.8 4.5,40.8 3.44,39.74 3.44,37.82 U9.6 | U9.6 3.75,36.74 v3.2,36.2 | C4.2 5.19,37.48 3.78,37.48 U9.6 | T5.5 6.97,34.12 C22.2 9.45,36.59 U8.6 | C12.2 C3.2 19.1,11.04 19.1,10.8 | U8.6 9.64,37.32 C17.2 | IC1.18 27.82,8.59 27.5,8.9 27.5,9.5 26.7,10.3 26.7,10.8 27.4,11.5 27.4,12.6 27.2,12.8 26.5,12.8 25.2,11.5 25.2,10.7 23.68,9.19 v21.64,9.19 20.39,9.19 IC1.6 19.72,9.38 19.1,10.01 19.1,10.8 | v55.3,19.1 55.4,19.2 v55.4,20.8 | v10.5,22.7 10.4,22.6 9.8,22.6 9.66,22.46 U3.4 9.7,21.79 C5.2
  Top 0.305: IC1.18 29.68,8.59 30.9,9.8 31.6,9.8 33.13,11.33 IC2.1
  Bottom 0.152: 37,13.8 37,11.9 37.32,11.58 37.32,10.12 37.3,10.1 | 37,13.8 36.5,14.3 34.4,14.3 IC2.1 | 37,13.8 37.5,14.3 49.2,14.3 49.6,13.9 v49.6,11.6 | v49.6,11.6 49.6,8.7 47.5,6.6 v46.4,6.6 | IC4.28 13.79,22.21 v15.5,20.5 | v30.2,20.7 30.1,20.6 15.6,20.6 v15.5,20.5 | v3.2,36.2 2.9,35.9 2.9,24.7 1.5,23.3 1.5,19.8 2.8,18.5 5.3,18.5 6.3,17.5 7,17.5 7.5,18 9.6,18 C6.2 11,19.4 11.1,19.4 11.21,19.5 11.21,20.2 C2.2 | v15.5,20.5 11.38,20.5 C2.2 | R43.2 17.05,25.75 U$11.#4 | C7.1 17.05,26.85 R43.2 | 23.04,25.34 20.99,27.4 17.85,27.4 R43.2 | 23.1,25.29 23.04,25.34 | 23.04,25.34 23.04,23.56 23.3,23.3 24.1,23.3 24.7,23.9 25.41,23.9 25.47,23.84 34.96,23.84 36.9,21.91 46.93,21.91 47.83,21 55.2,21 v55.4,20.8 | v55.3,19.1 54.7,18.5 54.7,14.29 IC2.17 52.02,11.6 v49.6,11.6 | C2.2 10.5,20.91 v10.5,22.7 | R23.2 35.15,10.5 36.9,10.5 37.3,10.1 | 37.3,10.1 R22.2
5V  (via drill 0.35)
  Top 0.152: R30.2 15.3,19.6 18.7,19.6 19.4,20.3 20.5,20.3 21.51,19.29 23.7,19.29 v23.75,19.34 | v12.4,25.9 14.6,23.7 24,23.7 27,26.7 28.5,26.7
  Top 0.254: v71.7,11.3 72,11.6 v72.7,11.6 73.5,10.8 82.6,10.8 83.3,11.5 83.3,17 83,17.3 v46.9,17.3 46.2,18 v46.1,18 45.6,18 v45.2,17.6
  Top 0.305: IC2.2 32.1,16.61 32.1,19.51 32.07,19.54 32.07,20.13 28.5,23.7 28.5,26.7 28.5,42.2 31,44.7 31,47.9 v29.9,49
  Bottom 0.152: 22.7,17.7 LED-SPI.5V | R8.2 5.45,38.15 U11.1 7.25,38.88 7.25,40.09 7.15,40.2 7.15,41.19 7.25,41.29 R9.2 7.25,42.15 7.4,42.3 8.58,42.3 8.83,42.05 8.83,41.67 9.3,41.2 9.3,40.21 9.9,39.61 9.9,35.3 | U10.1 8.53,33.45 9.9,34.83 9.9,35.3 | v23.75,19.34 23.7,19.29 23.7,18.5 | v12.4,25.9 12.4,33.29 10.39,35.3 9.9,35.3 | 30.93,53.1 REAR_LED.2:POWER 30.93,52.53
  Bottom 0.254: IC2.2 34.76,17.2 46.8,17.2 v46.9,17.3
  Bottom 0.305: IC2.2 30.2,18.5 23.7,18.5 23.5,18.5 22.7,17.7 | I2C.5V 72.8,11.5 v72.7,11.6 | v29.9,49 29.9,49.9 30.93,50.93 30.93,52.53 30.93,53.1 30.93,55.23 31.8,56.1 39.1,56.1 39.63,55.57 FRONT_LED.2:POWER
  pour Bottom (no thermals): 72.6,10.1 71.7,11 71.6,11 71.4,11.2 71.4,11.6 71.7,11.9 72.9,11.9 73.7,11.1 73.7,10.5 73.3,10.1
  pour Top (no thermals): 72.13,10.47 71.4,11.2 71.4,11.5 71.8,11.9 73.1,11.9 74.22,10.78
  pour Bottom (no thermals): 44.9,17 44.4,17.5 44.4,18 44.9,18.5 45.7,18.5 46.2,18.5 47.3,17.4 47.3,17.1 47.2,17
  pour Top: 44.3,17.4 44.3,17.9 44.9,18.5 47.2,18.5 47.3,18.4 48.1,18.4 48.7,17.8 48.7,17.5 48.1,16.9 44.8,16.9
AVR_MISO
  Top 0.152: IC1.16 27.98,5.6 48.5,5.6 49.9,7 49.9,9.6 48.7,10.8 46.8,10.8 45.9,9.9 45.9,9.3 ICSP1.1
AVR_MOSI  (via drill 0.35)
  Top 0.152: ICSP1.4 44.66,7.46 43.5,6.3 28.6,6.3 27.5,7.4 27.3,7.4 | 27.3,7.4 26.6,7.4 26.29,7.09 IC1.15 | v26.8,12 25.8,11 25.8,8.9 27.3,7.4
  Bottom 0.152: LED-SPI.DI 26.7,12.1 v26.8,12
AVR_RESET  (via drill 0.35)
  Top 0.152: ICSP1.5 43.39,10.31 42.5,11.2 40.5,11.2 39.9,10.6 38.2,10.6 37.1,9.5 34.6,9.5 33.5,8.4 v30.8,8.4 | v24.4,10.7 24.4,10.8 23.1,12.1 23.1,13.3 23.89,14.09 IC1.29 23.89,15.09 24.9,16.1 24.9,19.24 23.67,20.47 R2.1
  Bottom 0.152: v30.8,8.4 25.8,8.4 24.9,9.3 24.9,10.2 v24.4,10.7
AVR_RX
  Top 0.152: IC1.30 23.09,15.39 23.4,15.7 23.7,15.7 24,16 24,17.9 23.68,18.23 R12.2
AVR_SCK  (via drill 0.35)
  Top 0.152: ICSP1.3 44.66,10.66 v44.7,10.7 | v26.64,9.24 26.64,9.04 27.2,8.49 27.2,8.3 27.71,7.79 IC1.17 30.11,7.79 30.5,7.4 36.7,7.4 37.1,7 39.8,7 v39.98,7.18
  Bottom 0.152: v44.7,10.7 44,10.7 43.1,11.6 41,11.6 40.6,11.2 40.6,7.7 40.09,7.18 v39.98,7.18 | v26.64,9.24 25.5,10.39 25.5,11.37 25.5,11.71 24.7,12.5 LED-SPI.CI
AVR_TX
  Top 0.152: IC1.31 22.29,16.14 R13.2
D3  (via drill 0.35)
  Top 0.152: RC.ANODE 59.62,4.9 52.6,4.9 v52.4,5.1 | v23,10 22.7,10.3 22.7,10.8 22.6,10.9 22.6,12.5 21.71,13.38 IC1.1
  Bottom 0.152: v52.4,5.1 23.9,5.1 23.1,5.9 23.1,9.9 v23,10
D4  (via drill 0.35)
  Top 0.152: JETSON.ANODE 50.44,6.24 49.1,4.9 v22.7,4.9 | v21.6,12 21.02,12.59 IC1.2
  Bottom 0.152: v22.7,4.9 22.4,5.2 22.4,9.5 21.6,10.3 v21.6,12
GND  (via drill 0.35)
  Top 0.152: IC1.21 29.06,10.98 29.84,11.77 C1.1 30.02,12.1 v31.2,12.1 v31.2,10.8 | ICSP1.6 43.56,7.83 v43.56,7.14 | 16.3,8.29 X2.2 | IC1.5 21.09,10.19 21.3,10.4 21.3,11.23 20.8,11.74 20.24,11.74 IC1.3 19.46,11.79 C3.1 C12.1 16.38,12.72 v16,13.1 15.1,14 v15.1,14.5 | v28.4,17.3 26.85,18.85 v26.85,19.8 | v6.5,39.2 6.57,39.13 6.57,38.9 | 6.57,38.9 6.57,37.85 U8.4 6.91,36.41 v6.8,36.3 6.4,35.9 4.4,35.9 4.1,35.6 4.1,34.7 3.6,34.2 | 3.52,34.12 3.6,34.2 | 15.8,17.9 v17.1,16.6 17.1,17.2 v17.9,18 | 55.99,15.5 55.99,14.79 55.5,14.3 49.65,14.3 IC2.14 47.09,14.3 44.55,14.3 IC2.9 41.95,11.7 40,11.7 39.4,11.1 37.8,11.1 37.6,10.9 36.8,10.9 36.46,11.24 v36.2,11.24 35.1,11.24 v33.7,9.84 | 55.99,15.5 IC2.20 | IC2.25 62.34,14.3 57.19,14.3 55.99,15.5 | IC2.25 64.88,14.3 67.7,14.3 68.69,15.29 | 68.69,15.29 IC2.30 | 68.69,15.29 69.58,14.4 72.59,14.4 IC2.34 75.05,14.3 80.12,14.3 IC2.39 | 6.2,25.2 5.7,25.2 5.3,25.6 5.3,29 6.7,30.4 v6.7,30.6 6.7,30.7 6.2,31.2 6.2,32.32 7.28,33.4 7.47,33.4 C22.1 | 6.2,25.2 10.1,25.2 v10.4,25.5 | v32.7,19.8 32.7,20.7 30.4,23 v37.4,23 v40.4,23 | C4.1 5.5,38.9 6.57,38.9 | C17.1 11,39.05 11,40 v10.4,40.6 | v60.4,9 v57.4,9 v54.4,9 54.4,11.3 v54.3,11.4 | v60.4,9 63.61,12.21 | 63.61,12.21 IC2.25 | v82.4,21 81.4,22 v81.4,23 v78.4,23 75.5,23 | 75.5,23 v75.4,23 v72.4,23 v69.4,23 v66.4,23 v63.4,23 | v63.4,23 v60.4,23 v56.4,23 v52.4,23 | v52.4,23 v48.4,23 v44.4,23 v40.4,23 | v40.4,23 40.4,20.4 v39.5,19.5 | v2.4,39.1 2.3,39 1.3,39 1.21,38.91 U9.4 1.21,35.99 v1.7,35.5 1.7,34.5 2.05,34.15 | v16.3,19 16.3,18.4 15.8,17.9 | v37.6,7.94 37.63,7.97 | 37.63,7.97 39.16,9.5 39.6,9.5 v39.6,9.7 | v16,7.7 16.3,8 16.3,8.29
  Top 0.152: v16,9.1 16.3,8.8 16.3,8.29 | 2.08,34.12 2.05,34.15 | TP3.1 63.21,22.81 v63.4,23 | v10.7,17.6 8.3,17.6 7.4,18.5 v6.7,18.5 6.5,18.3 2.7,18.3 1.3,19.7 1.3,25.3 v1.9,25.9 | 65.8,6.22 R5.1 65.9,5.95 v65.9,4.1 | v1.2,31.8 2,31 v2,30.7 | 66.25,9.05 v66.2,9 v60.4,9 | 66.25,9.05 v68,10.8 | 63.61,12.21 63.61,11.99 v65.4,10.2 66.25,9.35 66.25,9.05 | v81.1,9.4 80.8,9.7 v78.3,9.7 v75.6,7 v74.3,5.7 | v34.8,8.24 37.36,8.24 37.63,7.97 | 2.05,34.15 3.1,34.15 T5.2 3.21,34.2 3.6,34.2 | v52.7,18.9 52.7,22.7 v52.4,23 | v75.2,18.2 75.2,22.7 75.5,23 | R36.1 13.75,17.2 T2.2 14.45,17.9 15.8,17.9 | 28.6,21.8 v28.7,21.8 | v26,24.8 26.8,25.6 v27,25.6 27.6,25 v27.6,24.8 | v21.9,29.1 23.1,30.3 24.1,30.3 24.4,30 24.4,27.6 24.3,27.5 24.3,27.3 v24.4,27.2 | v6.2,25.26 6.2,25.2 | C5.1 9.15,19.45 v8.5,20.1 7.88,20.72 R24.1 | R10.1 59.17,7.77 v60.4,9 | v74.3,5.7 75.4,4.6 v75.4,4.1 76.6,5.3 v76.6,5.6 76.6,4.8 v77.3,4.1 | v73,4.1 73,4.4 v74.3,5.7 | v74.3,5.7 73.1,6.9 v73,6.9 v71.8,5.7 70.6,4.5 v70.6,4.1 | v43.5,47.9 43.5,45.4 v43.2,45.1 | v39.1,44.2 39,44.1 v34.3,44.1
  Top 0.305: 28.6,21.8 27.6,22.8 v27.6,24.8 | v25.4,21.4 26.85,19.95 v26.85,19.8
  Bottom 0.152: v43.56,7.14 44.8,5.9 | 44.8,5.9 48.8,5.9 53.3,10.4 61.4,10.4 63.61,12.61 IC2.25 | IC2.14 48.37,17.03 45.6,19.8 39.6,19.8 39.6,19.5 | v26.85,19.8 26.55,20.1 22.5,20.1 20.7,18.3 LED-SPI.GND 20.5,16.6 v17.1,16.6 17,16.6 16.6,16.2 16.6,14.2 16,13.6 v16,13.1 v16,11.9 16,11.1 v16.5,10.6 16,10.1 v16,9.1 | 32.8,19.7 33,19.5 v39.5,19.5 39.6,19.5 | v31.2,12.1 31.2,15.7 29.6,17.3 v28.4,17.3 | 12.6,24.81 9.3,24.81 | 9.3,24.81 IC4.5 | IC4.4 7.91,24.2 8.8,24.2 | 8.8,24.2 9.3,24.7 9.3,24.81 | 8.8,24.2 8.8,23.6 8.71,23.51 IC4.3 7.1,23.51 | IC4.2 6.94,22.86 6.8,23 | 6.8,23 6.8,23.3 7.01,23.51 7.1,23.51 | 6.8,23 6.8,22.4 7,22.2 7.01,22.21 IC4.1 8.89,22.21 9.5,21.6 9.5,20.36 9.4,20.27 | C2.1 9.4,20.27 | 9.4,20.27 8.66,20.27 v8.5,20.1 8.5,19.3 C6.1 8.5,18.5 v6.7,18.5 | IC4.14 6.86,30.66 | 6.86,30.66 6.76,30.66 v6.7,30.6 | v10.4,25.5 11.91,25.5 12.6,24.81 | v1.9,25.9 v1.9,28.6 2,28.7 v2,30.7 2.3,31 2.3,34.9 v1.7,35.5 | v33,17.9 33.1,18 v35.8,18 36.3,18.5 39,18.5 39.6,19.1 39.6,19.5 | v2.4,39.1 v4.3,39.1 4.4,39.2 v6.5,39.2 6.6,39.3 6.6,40.8 6.1,41.3 6.1,42.1 6.9,42.9 9,42.9 9.9,42 9.9,41.1 v10.4,40.6 | v25.1,7.9 25.4,7.9 25.8,7.5 36.9,7.5 37.34,7.94 v37.6,7.94 | IC2.30 70,14.27 70,10.2 I2C.GND | 12.6,24.81 IC4.24 15.06,24.81 R3.1 15.88,24.27 R1.1 16.41,24.8 17.5,24.8 18.15,24.15 18.15,23.85 | v10.7,17.6 11.7,17.6 14.8,14.5 v15.1,14.5 | 44.8,5.9 39.5,5.9 39.1,6.3 39.1,7.7 40,8.6 40,9.3 v39.6,9.7 | v51.2,10.6 51.8,10.6 52.1,10.9 53.5,10.9 54,11.4 v54.3,11.4 | v52.5,7.6 53.9,9 v54.4,9 | S1.3 6.76,23.85 7.1,23.51 | v19.9,6.2 18,6.2 v17.7,5.9 16,7.6 v16,7.7 | IC2.39 81.39,9.69 v81.1,9.4 | v65.4,10.2 65.4,4.6 v65.9,4.1
  Bottom 0.152: v83,18.3 83,20.4 v82.4,21 | U$6.1 6.2,26.8 6.2,26.35 R17.1 6.65,25.71 v6.2,25.26 | U$6.4 4.85,29.9 R26.1 4.5,30.45 4.5,31.1 5.09,31.7 5.83,31.7 6.86,30.66 | C8.2 18.15,23.85 | 18.15,23.85 U$11.#2 18.6,23.5 20,23.5 20.35,23.85 R44.1 | M1.2 37.9,49.25 37.95,49.25 | v26,24.8 25.6,24.4 v23.8,24.4 23.8,24.5 24.4,25.1 v24.4,27.2 | C7.2 16.25,28.2 16.8,28.2 17.5,28.9 21.7,28.9 v21.9,29.1 | 28.1,28.1 27.5,27.5 v27.3,27.5 | 38.7,46.4 42,46.4 v43.5,47.9 | v43.2,45.1 42.3,44.2 v39.1,44.2
  Bottom 0.305: v27.6,24.8 28.1,25.3 28.1,28.1 R42.1 29.2,45 32.6,45 33.25,45.65 | v28.7,21.8 25.8,21.8 v25.4,21.4 | v26.85,19.8 v32.7,19.8 32.8,19.7 | M4.2 32.2,48.45 32.2,46.7 33.25,45.65 | 37.9,49.25 38.7,48.45 38.7,46.4 38.7,46 37.6,44.9 35.6,44.9 R41.1 33.5,45.9 33.25,45.65
  pour Top (rank 3): -8.92,100.72 123.22,100.72 123.22,-1.57 -8.92,-1.57
  pour Bottom (rank 3): -7.58,100.17 125.07,100.17 125.07,-0.07 -7.58,-0.07
N$2
  Bottom 0.152: 7.86,26.1 IC4.7 7.49,26.11 7.1,26.5 7.1,27.4 6.8,27.7 5.7,27.7 5.5,27.5 U$6.2 5.55,26.8 R17.2
N$3
  Top 0.152: IC3.3 20.35,38.55 19,37.2 16.3,37.2 15.78,36.67 15.78,33.23 16.3,32.7 19.7,32.7 21.18,31.23 Q1.D | Q1.D 21.07,30.22 | 21.48,27.88 R19.1 20.9,28.34 20.9,30.05 Q1.D
N$4
  Top 0.152: IC1.20 28.52,10.31 C1.2
N$5
  Top 0.152: IC1.8 19.5,7.09 X2.3
N$6
  Top 0.152: R12.1 20.77,18.23 TP1.1
N$7
  Bottom 0.152: 13.76,25.5 IC4.23 14.62,25.46 R3.2
N$8
  Bottom 0.152: 13.8,24.24 IC4.25 13.76,24.2 14.5,24.2 14.52,24.22 R1.2 14.72,23.98 15.3,23.4 16.5,23.4 16.9,23.8 | U$11.#3 16.9,23.8 | C8.1 16.9,23.05 16.9,23.8
N$9
  Top 0.152: R15.1 4.23,42.27 3.75,42.76 U9.1
N$10
  Top 0.152: T5.1 3.12,35.27 2.48,35.92 U9.5
N$11  (via drill 0.35)
  Top 0.152: U8.5 8.18,38.73 6.8,40.1 5.89,40.1 v5.84,40.14 | T5.3 1.63,33.17 v1.3,33.5
  Bottom 0.152: v5.84,40.14 5.8,40.1 v1.8,40.1 0.7,39 0.7,34.1 v1.3,33.5
N$12
  Top 0.152: U8.1 10.39,42.87 R16.1
N$13  (via drill 0.35)
  Top 0.152: v4.5,25.9 4.5,29.94 v5.5,30.94
  Bottom 0.152: U$6.5 5.5,29.45 R26.2 6.05,30.06 5.84,30.27 5.84,30.6 v5.5,30.94 | 8.6,25.5 7.91,25.5 IC4.6 7.8,25.4 7.4,25.4 6.7,24.7 5.4,24.7 4.5,25.6 v4.5,25.9
N$14
  Bottom 0.152: T6.1 18.3,36.5 16.1,36.5 15.6,36 15.6,35.2 15.12,34.72 U10.5
N$15
  Top 0.152: IC1.7 19.71,8.59 18.8,9.5 18.8,9.4 18.1,9.4 X2.1
N$16  (via drill 0.35)
  Top 0.152: IC1.9 20.29,5.29 19.09,5.29 v18.9,5.1 | v7.65,19.35 8.4,18.6 10.2,18.6 10.5,18.9 11.3,19.7 12.4,19.7 v13.3,18.8
  Bottom 0.152: v18.9,5.1 16.9,5.1 15.1,6.9 15.1,13.4 15.9,14.2 15.9,14.8 13.3,17.4 v13.3,18.8 | S1.2 5.35,21.65 v7.65,19.35
N$17
  Top 0.152: R13.1 19.88,16.73 TP2.1
N$18
  Bottom 0.152: U11.5 18.38,39.42 20.52,37.27 T6.3
N$19
  Top 0.152: RC.CATHODE 63.96,6.17 R5.2
N$20
  Top 0.152: JETSON.CATHODE 57.46,6.24 R10.2
N$21
  Bottom 0.152: U$6.6 6.15,28.66 5.7,28.2 5.67,28.2 5.37,27.9 4.4,27.9 3.9,28.4 3.9,31.7 4.3,32.1 6.65,32.1 R4.2
N$22
  Bottom 0.152: U$6.3 4.35,26.85 3.3,27.9 3.3,32.3 3.75,32.75 R6.2
N$23
  Bottom 0.152: R6.1 5.6,34.4 6.5,35.3 7.33,35.3 U10.3 8.02,36.43 7.55,36.9 R8.1
N$24
  Bottom 0.152: R4.1 6.7,33.7 7.7,34.7 8.6,34.7 9.4,35.5 9.4,39.27 U11.3 7.97,41.33 R9.1
N$25
  Top 0.152: R27.1 7.85,27.2 8.6,27.2 9.66,28.26 U3.1 9.66,29.16 R25.2
N$26
  Top 0.152: R27.2 7.05,29.6 T1.3 8.39,29.11 U3.2
N$27
  Top 0.152: T1.1 8.35,32.5 R32.1 R28.1
N$28
  Top 0.152: R33.1 1.4,46.9 RC_POWER.CATHODE
N$29
  Top 0.152: T2.1 12.35,17 R36.2 12.65,16.2 13.25,15.6 R35.1
N$30
  Top 0.152: U7.2 12.51,20.76 R34.1 13.05,20.1 T2.3
N$31
  Bottom 0.152: IC5.4 9.47,49.27 C14.2
N$32
  Bottom 0.152: R31.2 13.18,49.02 12.07,50.12 IC5.3
N$33
  Top 0.152: R30.1 13,21.9 13,22.46 12.86,22.61 12.79,22.61 12.6,22.8 11.7,22.8 11.24,22.34 U7.1 11.24,20.81 R34.2
N$34  (via drill 0.35)
  Top 0.152: v19.7,31.9 19.63,31.97 Q2.S
  Bottom 0.152: v19.7,31.9 20.52,32.73 T6.4
N$35  (via drill 0.35)
  Top 0.152: U$1.15:TH_SINGNAL 38.14,51.26 38.5,50.9 41.4,50.9 42.1,51.6 42.1,56.8 41.2,57.7 v26.9,57.7
  Bottom 0.152: R21.2 26.9,53.55 v26.9,57.7
N$36  (via drill 0.35)
  Top 0.152: U$1.11:ST_SIGNAL 27.98,51.38 27.4,50.8 v27.3,50.8
  Bottom 0.152: v27.3,50.8 26.25,50.8 R20.2
N$37  (via drill 0.35)
  Top 0.152: Q1.S 22.77,31.97 22.77,35.02 v22.6,35.2
  Bottom 0.152: v22.6,35.2 21.9,34.5 18.9,34.5 18.5,34.1 18.5,33.7 T6.6
N$38  (via drill 0.35)
  Top 0.152: v23.5,33.5 26.1,33.5 27.8,35.2 27.8,42.7 30.1,45 30.1,47.6 29.1,48.6 29.1,49.4 29.6,49.9 31.4,49.9 31.7,49.6 32.2,49.6 v32.3,49.5
  Bottom 0.152: IC4.19 13.76,28.1 14.7,28.1 15.3,28.7 16.6,28.7 17.2,29.3 19.3,29.3 21.2,31.2 21.2,32.1 22.6,33.5 v23.5,33.5 | v32.3,49.5 32.7,49.1 32.7,47.6 33,47.3 R37.2
N$39
  Top 0.152: R11.1 19.38,29.22 Q2.G
N$40
  Top 0.152: R18.1 23.38,29.27 Q1.G
N$41  (via drill 0.35)
  Top 0.152: v27,35.5 27,35.3 25.6,33.9 24.6,33.9 23.9,34.6 v23.9,34.7
  Bottom 0.152: R38.2 27.3,46.8 27.3,35.8 v27,35.5 | IC4.18 14.61,28.71 15,29.1 16.3,29.1 16.9,29.7 18.9,29.7 20.7,31.5 20.7,32.3 23.1,34.7 v23.9,34.7
N$42
  Top 0.152: Q2.D 16.12,31.12 | 16.12,31.12 14.5,32.74 14.5,37.6 15.9,39 18.1,39 18.4,39.3 IC3.6 | R14.1 14.9,30.14 14.9,30.7 15.32,31.12 16.12,31.12
N$43
  Bottom 0.152: 37.45,47.3 M1.1
  Bottom 0.305: R41.2 R37.1 37.45,47.3
N$44
  Bottom 0.152: 29.75,47.55 R38.1
  Bottom 0.305: M4.1 31.15,47.6 R38.1 R42.2
N$45
  Bottom 0.152: 42.2,52.87 FRONT_LED.1:GND
  Bottom 0.305: R39.2 42.2,52.87
N$46
  Bottom 0.305: M1.3 39.9,48.8 R39.1
N$47
  Bottom 0.305: M4.3 35.3,48.5 35.8,49 R40.1
N$48
  Bottom 0.305: REAR_LED.1:GND 33.47,50.73 R40.2
N$49
  Bottom 0.152: R43.1 18.15,25.75 U$11.#1 18.4,25.5 18.9,25.5 19.25,25.15 R44.2
PCH1  (via drill 0.35)
  Top 0.152: IC3.2 21,43.8 19.9,44.9 19.5,44.9 17.82,46.58 v17.82,46.7 U$1.7:SIGNAL1 17.82,48.28 | R16.2 14.77,42.87 v15.1,43.2
  Bottom 0.152: v15.1,43.2 15.1,43.98 v17.82,46.7
PCH2
  Top 0.152: IC3.5 19.05,43.35 18.1,44.3 16.5,44.3 16,44.8 11.7,44.8 10.2,46.3 10.2,52.1 | R15.2 5.38,44.77 5.7,45.1 6,45.1 6.5,45.6 6.5,48.4 10.2,52.1 | 10.2,52.1 10.2,52.6 U$1.4:SIGNAL2
PCH3
  Top 0.152: IC1.26 26.29,19.01 24,21.3 18.9,21.3 18.3,20.7 16.8,20.7 15.9,21.6 14.5,21.6 12.7,23.4 9,23.4 8.39,22.79 U3.3 7.9,22.32 R24.2
PCH6  (via drill 0.35)
  Top 0.152: R29.2 12.62,28.48 U7.3 13.57,27.3 16.9,27.3 v17.6,28 | IC3.1 21.65,39.25 v22.2,38.7
  Bottom 0.152: v22.2,38.7 24.8,36.1 24.8,30.4 22.7,28.3 17.9,28.3 v17.6,28
PCH_1
  Top 0.152: IC1.32 20.8,14 16.9,14 16.5,14.4 16.5,14.9 15.8,15.6 R35.2
PCH_3  (via drill 0.35)
  Top 0.152: v8,43.8 8,43.6 9.1,42.5 10,42.5 12.4,40.1 12.4,36.8 11.7,36.1 10.9,36.1 9.45,34.65 R28.2 | U$1.1:SIGNAL3 3.8,51.78 3.8,51.4 4.8,50.4 v5.1,50.4
  Bottom 0.152: v5.1,50.4 5.8,49.7 R7.2 7.1,47.8 7.1,44.5 7.8,43.8 v8,43.8
PH1-328
  Top 0.152: IC1.23 28.5,12.7 29.4,12.7 30.7,14 30.7,18.7 26.8,22.6 15.1,22.6 13.2,24.5 4.8,24.5 3.6,25.7 3.6,30.3 5.72,32.42 T5.4
PH2_328
  Top 0.152: IC1.24 28.8,13.8 29.4,13.8 30.1,14.5 30.1,18.4 26.4,22.1 14.9,22.1 13.1,23.9 4.5,23.9 2.9,25.5 2.9,31.1 4.6,32.8 4.6,34.4 5.27,35.07 T5.6
RCH1  (via drill 0.35)
  Top 0.152: v19.7,42.7 IC3.4
  Bottom 0.152: v19.7,42.7 19.7,46.05 24.52,50.87 R20.1
RCH2  (via drill 0.35)
  Top 0.152: v17.7,43.2 17.7,40.6 IC3.7
  Bottom 0.152: R21.1 19,47.24 19,44.5 v17.7,43.2
SCL  (via drill 0.35)
  Top 0.152: v23.8,12.8 24.69,13.69 IC1.28 | IC2.5 37,14.24 37,20.6 v36.8,20.8
  Bottom 0.152: IC2.5 38.21,12.72 38.7,12.23 38.7,9.9 38.49,9.69 R22.1 38.53,8.87 38.53,7.43 37.8,6.7 25.1,6.7 24.1,7.7 24.1,10 23.4,10.7 23.4,11.1 23.8,11.5 v23.8,12.8 | IC4.26 13.72,23.5 14.3,23.5 16.1,21.7 23.4,21.7 25,23.3 34.3,23.3 v36.8,20.8 46.2,20.8 47.2,19.8 74.8,19.8 77.6,17 77.6,11.7 76.8,10.9 I2C.SCL
SDA  (via drill 0.35)
  Top 0.152: v25.5,13.1 v25.49,13.11 IC1.27 | v33.4,21.9 34.4,20.9 34.4,14.2 35.56,13.04 35.6,13.04 | 35.6,13.04 IC2.3 | 35.6,13.04 35.6,13 37,11.6 38.9,11.6 39.5,12.2 39.5,17.4 41.1,19 50.5,19 51.3,18.2 v73.8,18.2
  Bottom 0.152: v25.5,13.1 25.8,12.8 25.8,11.5 28.05,9.25 31.89,9.25 31.92,9.28 | 13.81,22.76 IC4.27 14.24,22.86 15.8,21.3 24.1,21.3 25.5,22.7 32.6,22.7 v33.4,21.9 | v73.8,18.2 75,17 75,11.7 74.8,11.5 I2C.SDA | 36.04,9.08 36.09,9.13 R23.1 35.98,9.3 34.6,9.3 34.3,9 32.2,9 31.92,9.28 | IC2.3 31.92,9.28
VCC_R  (via drill 0.35)
  Top 0.152: IC3.16 21.65,36.95 23.9,39.2 v23.9,39.3 | C20.2 23.08,40.12 v23.9,39.3 | v23.8,44.4 23.9,44.3 v23.9,39.3 | v21.8,46.3 19,49.1 v18.9,49.1 | v16.9,48.9 16.1,49.7 v16.1,50.4 | v26.7,32.9 26.7,27.8 23.86,24.96 23.57,24.96 23.21,24.6 19,24.6 17.1,26.5 12.1,26.5 11.24,27.36 U7.4 11.24,29.04 12,29.8 12,30.8 11.33,31.47 C19.2
  Bottom 0.152: IC5.1 12.88,52.27 C21.2 R31.1 14.82,50.62 D2.C 15.04,50.4 v16.1,50.4 | v23.8,44.4 23.7,44.4 v21.8,46.3 | v18.9,49.1 17.1,49.1 v16.9,48.9 | v26.7,32.9 26.3,33.3 26.3,38.3 25.3,39.3 v23.9,39.3
VCC_RC  (via drill 0.35)
  Top 0.152: v13.1,41.5 13.1,37.1 13.9,36.3 13.9,29.34 14.78,28.47 R14.2 16.67,28.47 17,28.8 17.8,28.8 18.3,28.3 18.3,26.5 19.8,25 21,25 21.48,25.48 R19.2 | RC_POWER.ANODE 1.2,55 2.9,56.7 3.4,56.7 | 3.4,56.7 5.12,54.98 U$1.2:VCC3 | 3.4,56.7 13.8,56.7 | U$1.8:VCC1 20.36,55.54 | 20.36,55.54 19.2,56.7 v16.5,56.7 13.8,56.7 | U$1.12:ST_VCC 30.52,56.08 | 30.52,56.08 29.9,56.7 21.52,56.7 20.36,55.54 | 30.52,56.08 31.24,56.8 40.1,56.8 40.68,56.22 U$1.16:TH_VCC | U$1.5:VCC2 12.74,55.64 13.8,56.7
  Bottom 0.152: v13.1,41.5 14.3,42.7 14.3,47.49 D2.A 16.9,50.09 16.9,56.3 v16.5,56.7
  pour Top (no thermals): 0.9,49 0.9,56.2 3.1,58.4 3.2,58.5 23.3,58.5 24.9,56.9 29.9,56.9 40.3,56.9 41.3,55.9 41.3,51.6 41.1,51.4 41,51.3 40.3,51.3 40.1,51.5 40.1,54.8 39.3,55.6 31.8,55.6 31.1,54.9 31.1,51.4 31,51.3 30,51.3 29.9,51.4 29.9,55.1 29.5,55.5 29.4,55.5 21.6,55.5 21,54.9 21,51.5 20.8,51.3 20,51.3 19.8,51.5 19.8,54.7 19,55.5 17.9,55.5 15.2,55.5 15.1,55.4 14.5,56 14.4,56 14.1,56.3 13.8,56.3 13.4,55.9 13.4,54.7 13.2,54.5 13.2,51.4 13.1,51.3 12.8,51.3 12.3,51.3 12.1,51.5 12.1,54.5 12.3,54.7 12.3,55.5 12.1,55.7 11.8,56 8.2,56 7,56 5.8,54.8 5.8,51.5 5.7,51.4 4.7,51.4 4.6,51.5 4.6,54.4 3.6,55.4 2.5,55.4 1.6,54.5 1.6,49.1 1.4,48.9 1,48.9
VCC_RC1  (via drill 0.35)
  Top 0.152: 23.38,25.77 R18.2 22.45,25.2 v22.4,25.2 | v16.1,29.9 16.3,30.1 17.3,30.1 18.1,30.9 19.1,30.9 20.4,29.6 20.4,25.9 v20.3,25.8 R11.2 | R25.1 10.78,30.52 v11.2,30.1 | v11.4,32.9 11.4,34.8 v11.9,35.3
  Bottom 0.152: T6.5 19.57,32.77 19.1,32.3 | 19.1,32.3 17.6,32.3 16.92,32.98 C24.2 | C18.2 14.3,38.12 | 14.3,38.12 U11.6 | 13.78,38.12 12.4,39.5 12.4,40.6 8.3,44.7 8.3,51.09 IC5.5 9.47,53.38 C15.2 | 13.78,38.12 14.3,38.12 | U10.6 14.2,33.45 | 14.2,33.45 12.95,33.45 11.9,34.5 v11.9,35.3 11.9,36.4 13.62,38.12 13.78,38.12 | 19.1,32.3 18.7,31.9 18.7,30.6 18.2,30.1 16.3,30.1 v16.1,29.9 14.53,31.48 C23.2 14.2,32.34 14.2,33.45 | v22.4,25.2 20.9,25.2 v20.3,25.8 | v11.2,30.1 11.15,30.15 11.4,30.4 v11.4,32.9

### Text on the board
tPlace: 3 | 2 | 1 | ST | TH | RC_POWER | D | #612 | J | Designed in Aizu | Rev 2.0.18 B | ICSP | RC | Jetson
bPlace: F-612-2-18-A-N-J-2-P | LED11 | LED12 | + | + | Designed in Aizu | Rev 2.0.18
Document: #612 JetRacer Rev 2.0.18 / 2022/03/03 Early / 2022/03/013 B